# EAGLE board Comms (EAGLE 9.6.2), part 1 of 3
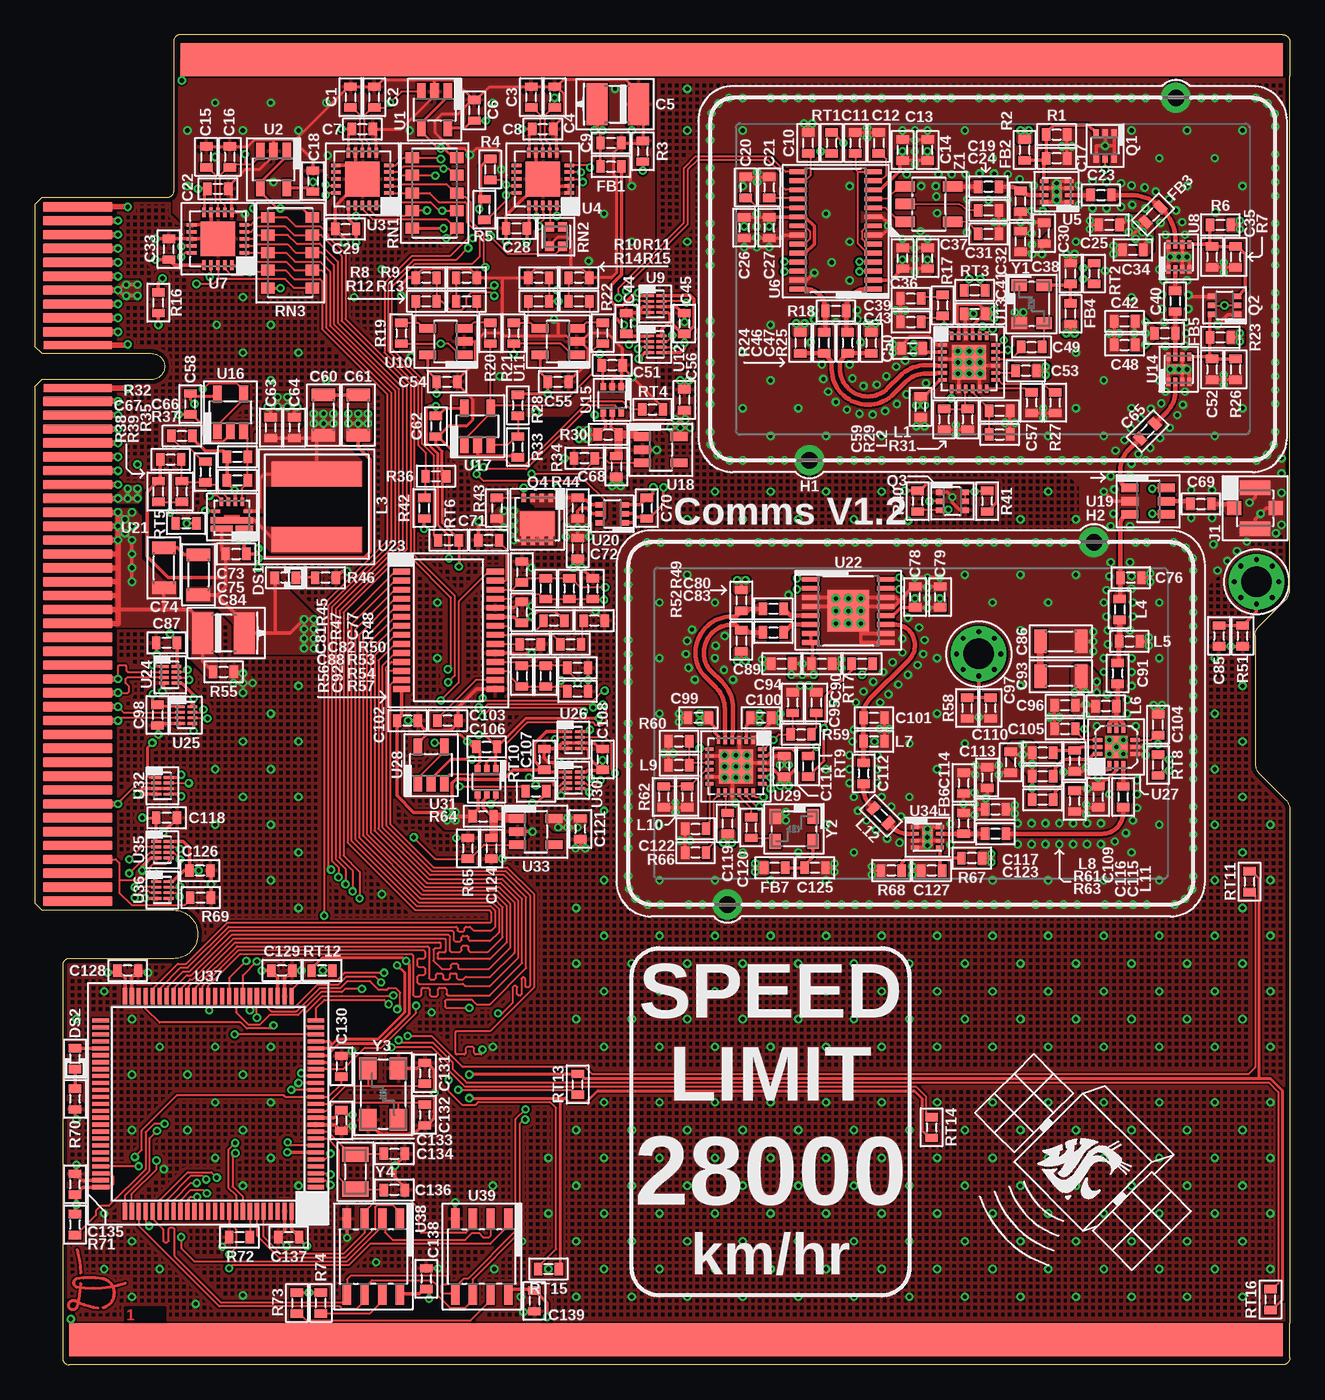
[diagram p14: board, top side]
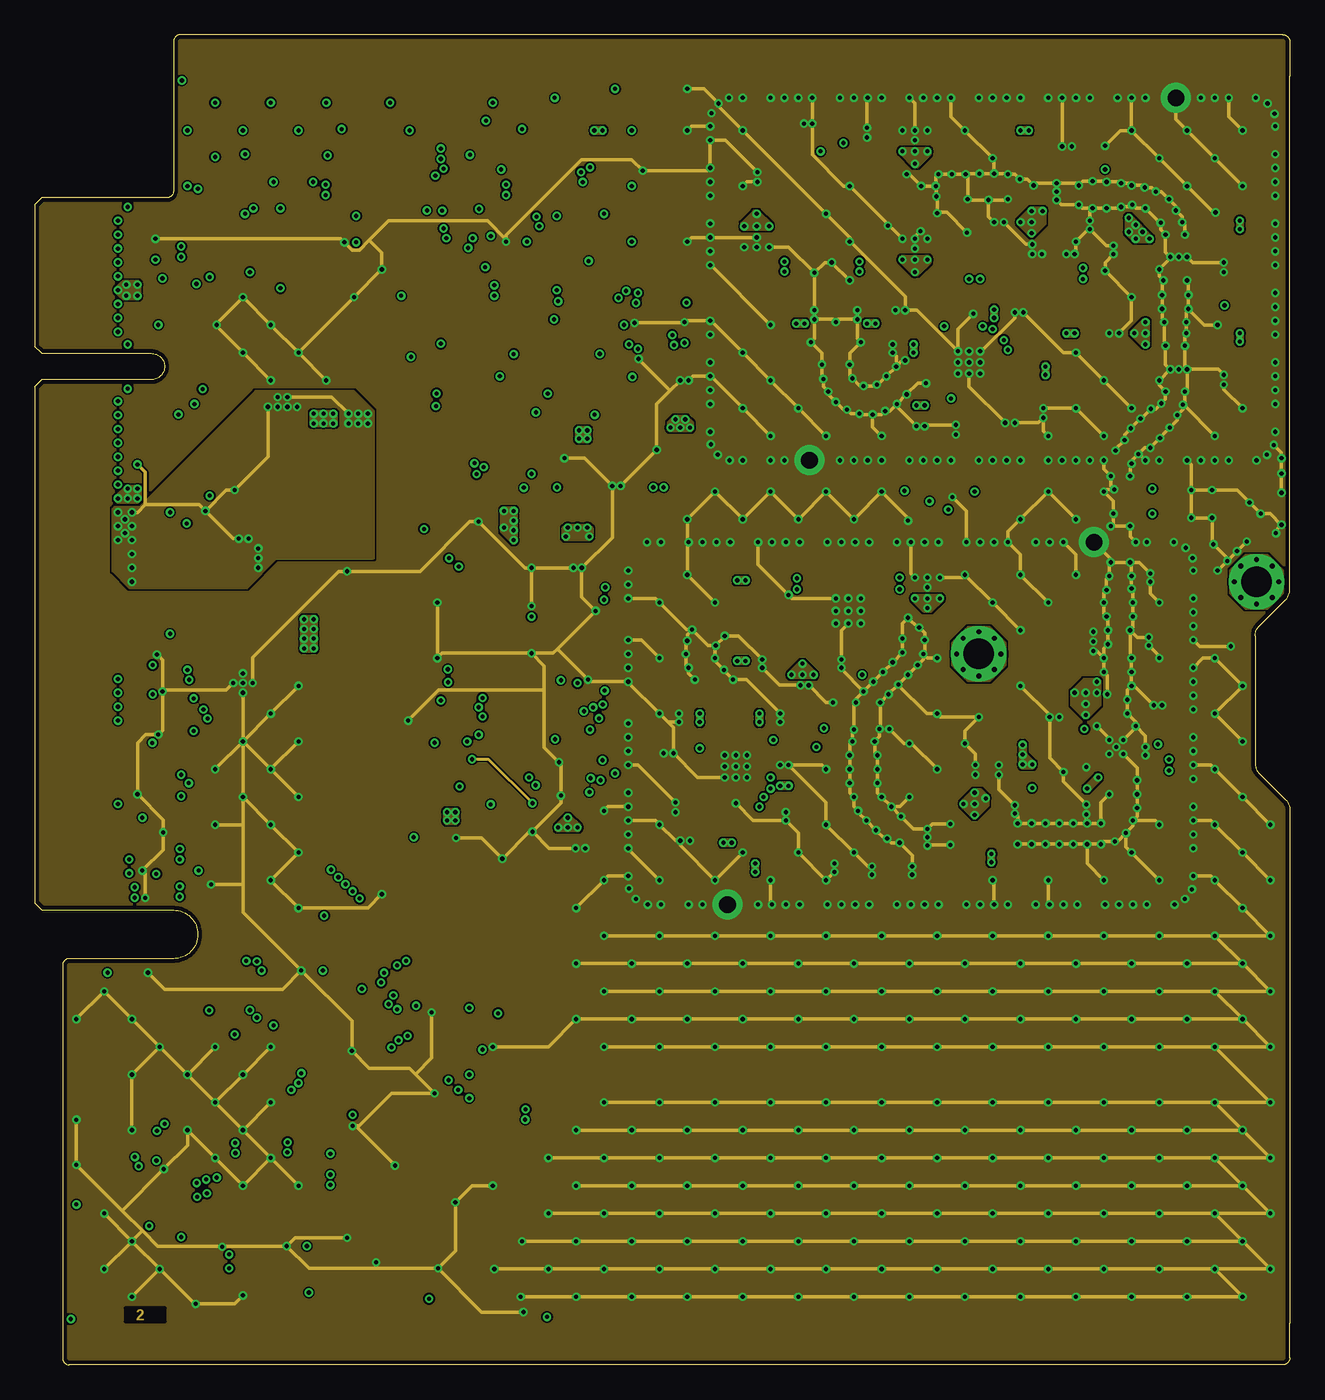
[diagram p15: board, inner layer Route2]
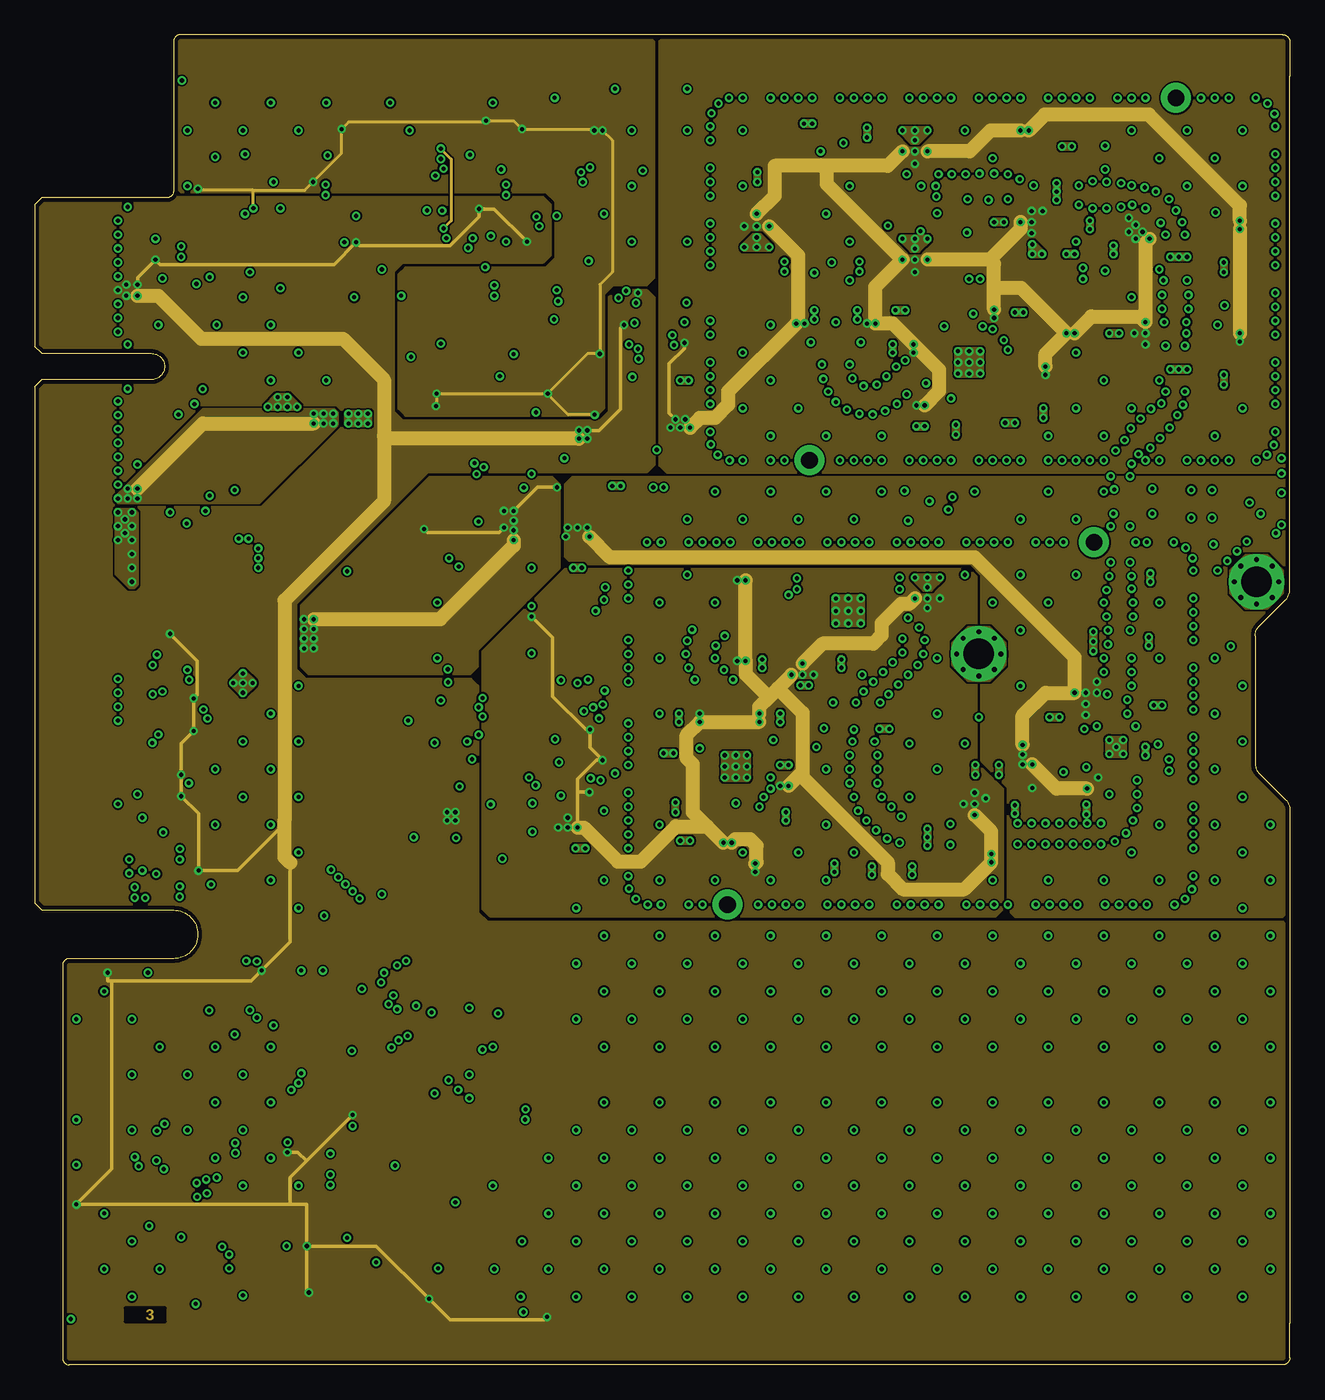
[diagram p16: board, inner layer Route15]
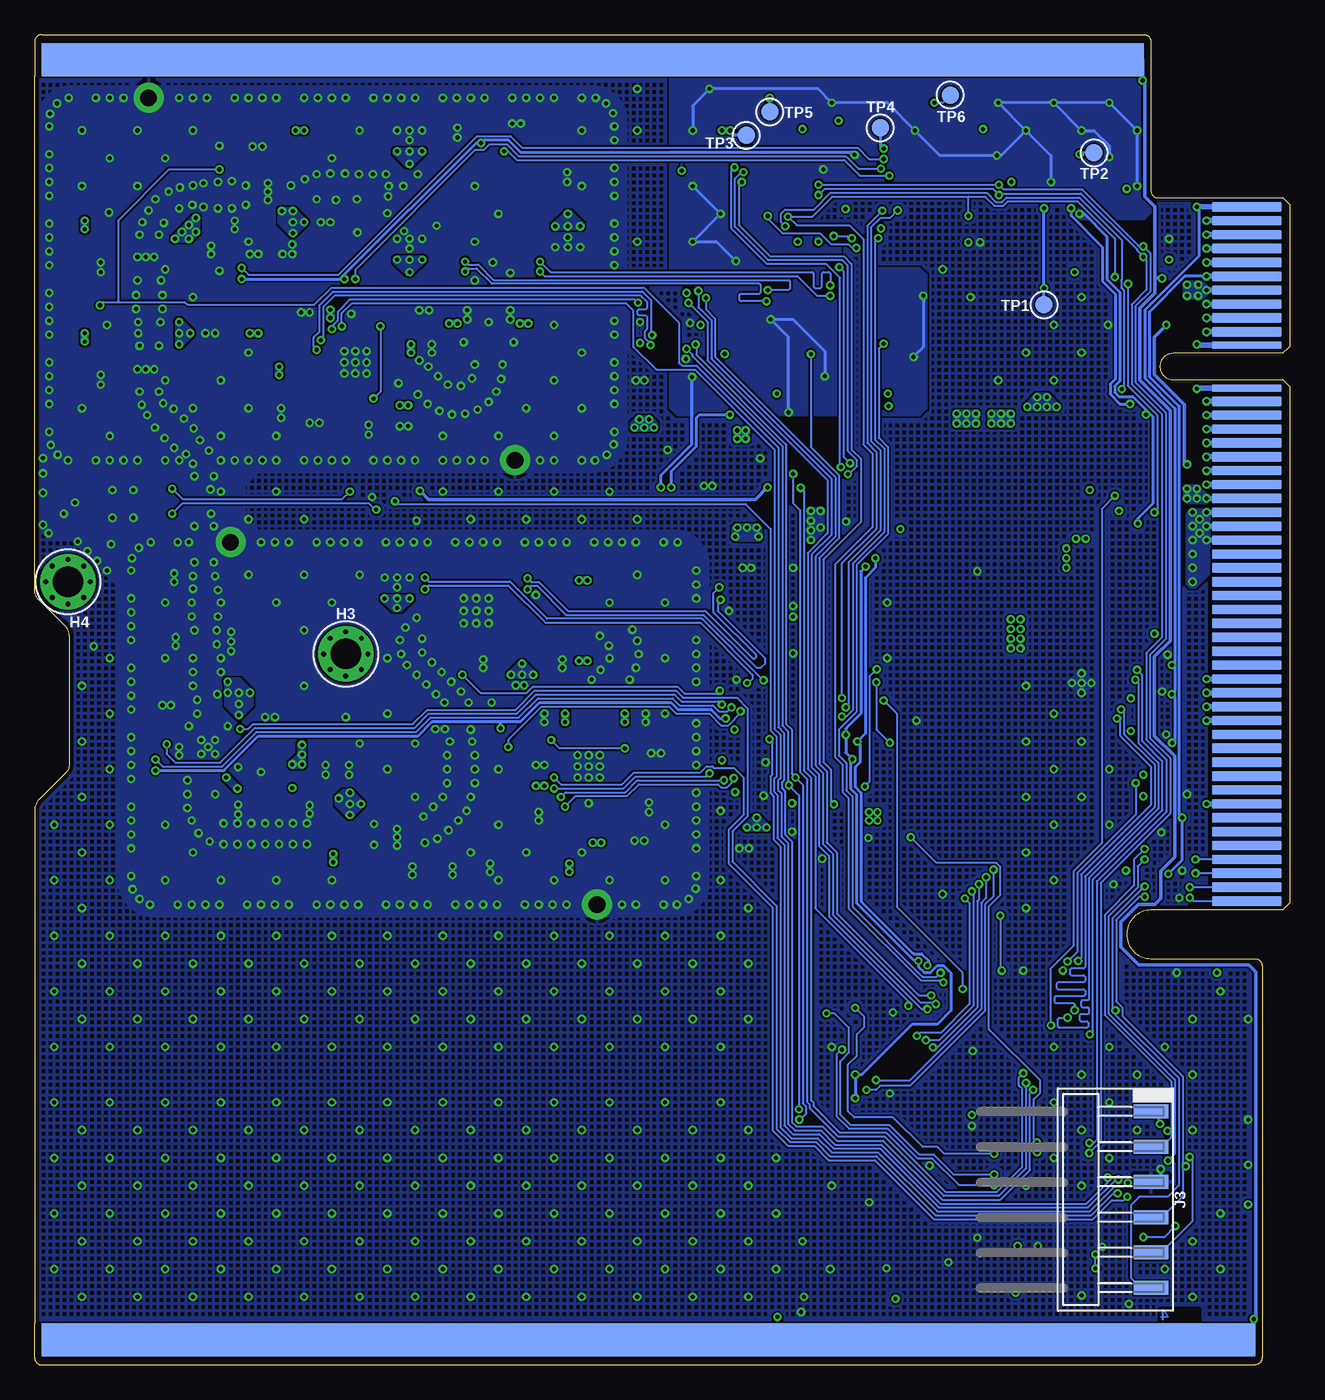
[diagram p17: board, bottom side, seen from below]

Size 90.4 x 95.8 mm. Coordinates in mm from the lower left corner, seen from the top.
Outline: 90.4,3 90.4,39.99 arc45 90.11,40.69 88.19,42.61 arc-45 87.9,43.31 87.9,52.49 arc-45 88.19,53.19 90.11,55.11 arc45 90.4,55.81 90.4,92.8
Copper layers (1+2*15+16): Top 0.035mm / dielectric 0.2mm / Route2 0.0175mm / dielectric 1.065mm / Route15 0.0175mm / dielectric 0.2mm / Bottom 0.035mm
Design rules "CougsInSpace-4Layer *": minimum track width 0.12mm, minimum drill 0.3mm, track to track 0.12mm, track to pad 0.12mm, pad to pad 0.12mm, via to via 0.12mm, smd to smd 0mil, copper to edge 0.3mm, drill to drill 0.3mm, minimum pad ring 0.15mm, minimum via ring 0.15mm, stop-mask expansion 0mil, vias tented up to drill 1mm, thermal gap 0.25mm
Net classes: 0 default: width 0.16 mm; 1 50Ohm: width 0.2 mm, clearance 0.2 mm; 2 200Ohm: width 0.1 mm, clearance 0.16 mm; 3 Supplies: width 0.25 mm; 4 AGND: width 0.2 mm
tRestrict: area 59.1,42.1 to 60.4,43; area 68.8,37.6 to 69.7,38.9; area 77.8,40.5 to 79.1,41.3; area 77.3,49.3 to 78.7,50.2; area 77.5,54 to 78.8,54.8; area 60.2,38.8 to 61.7,40.3; area 52.8,53.8 to 53.7,55.1; area 52.8,52.1 to 53.7,53.4; area 79.4,66.5 to 80.9,68; area 81.5,76.2 to 82.8,77; area 76.3,83.6 to 77.2,84.9; area 68.2,84.2 to 69.2,85.5; area 56.2,73.2 to 57.5,74; area 57.9,73.2 to 59.2,74

## Footprints (pad centres in the part's own frame; a part is rotated, then mirrored left to right if it is on the bottom)
1608 = smd 0.6 x 0.9: 1 -0.75,0; 2 0.75,0
4028-POL = smd 1.5 x 3: A 1.5,0; C -1.5,0
3216 = smd 0.9 x 1.7: 1 -1.45,0; 2 1.45,0
1608-POL = smd 0.6 x 0.9: A 0.75,0; C -0.75,0
SHIELD-2641 = drill 1.2 pad 1.7: 1 13.2,13.05; 2 -13.2,-13.05
MOUNTING_HOLE-2.2 = drill 2.2 pad 4: 1 0,0 | drill 0.35 pad 0.6: V1 1.6,0; V2 1.131,1.131; V3 0,1.6; V4 -1.131,1.131; V5 -1.6,0; V6 -1.131,-1.131; V7 0,-1.6; V8 1.131,-1.131
U.FL = smd 1 x 1: CENTER 0,-1.5; SHIELD@2 0,1.5 | smd 1.05 x 2.2: SHIELD@1 -1.475,0; SHIELD@13 1.475,0
CARD-FULL-OPEN+X = smd 5 x 0.7 bottom: A1 3.1,35.5; A2 3.1,34.5; A3 3.1,33.5; A4 3.1,32.5; A5 3.1,31.5; A6 3.1,30.5; A7 3.1,29.5; A8 3.1,28.5; A9 3.1,27.5; A10 3.1,26.5; A13 3.1,21.5; A14 3.1,20.5; A15 3.1,19.5; A16 3.1,18.5; A17 3.1,17.5; A18 3.1,16.5; A19 3.1,15.5; A20 3.1,14.5; A21 3.1,13.5; A22 3.1,12.5; A23 3.1,11.5; A24 3.1,10.5; A25 3.1,9.5; A26 3.1,8.5; A27 3.1,7.5; A28 3.1,6.5; A29 3.1,5.5; A30 3.1,4.5; A31 3.1,3.5; A32 3.1,2.5; A33 3.1,1.5; A34 3.1,0.5; A35 3.1,-0.5; A36 3.1,-1.5; A37 3.1,-2.5; A38 3.1,-3.5; A39 3.1,-4.5; A40 3.1,-5.5; A41 3.1,-6.5; A42 3.1,-7.5; A43 3.1,-8.5; A44 3.1,-9.5; A45 3.1,-10.5; A46 3.1,-11.5; A47 3.1,-12.5; A48 3.1,-13.5; A49 3.1,-14.5 | smd 5 x 0.6 bottom: A11 3.1,25.55; A12 3.1,22.45 | smd 5 x 0.7: B1 3.1,35.5; B2 3.1,34.5; B3 3.1,33.5; B4 3.1,32.5; B5 3.1,31.5; B6 3.1,30.5; B7 3.1,29.5; B8 3.1,28.5; B9 3.1,27.5; B10 3.1,26.5; B13 3.1,21.5; B14 3.1,20.5; B15 3.1,19.5; B16 3.1,18.5; B17 3.1,17.5; B18 3.1,16.5; B19 3.1,15.5; B20 3.1,14.5; B21 3.1,13.5; B22 3.1,12.5; B23 3.1,11.5; B24 3.1,10.5; B25 3.1,9.5; B26 3.1,8.5; B27 3.1,7.5; B28 3.1,6.5; B29 3.1,5.5; B30 3.1,4.5; B31 3.1,3.5; B32 3.1,2.5; B33 3.1,1.5; B34 3.1,0.5; B35 3.1,-0.5; B36 3.1,-1.5; B37 3.1,-2.5; B38 3.1,-3.5; B39 3.1,-4.5; B40 3.1,-5.5; B41 3.1,-6.5; B42 3.1,-7.5; B43 3.1,-8.5; B44 3.1,-9.5; B45 3.1,-10.5; B46 3.1,-11.5; B47 3.1,-12.5; B48 3.1,-13.5; B49 3.1,-14.5 | smd 5 x 0.6: B11 3.1,25.55; B12 3.1,22.45 | smd 79.4 x 2.4 bottom: CHASSIS@1 50.2,46.1 | smd 79.4 x 2.4: CHASSIS@2 50.2,46.1 | smd 87.4 x 2.4 bottom: CHASSIS@3 46.2,-46.1 | smd 87.4 x 2.4: CHASSIS@4 46.2,-46.1
SMD2.54-1X06-R = smd 1 x 2.5: 1 6.35,-5; 2 3.81,-5; 3 1.27,-5; 4 -1.27,-5; 5 -3.81,-5; 6 -6.35,-5
7575 = smd 1.78 x 6.5: 1 -2.36,0; 2 2.36,0
SOT363 = smd 0.5 x 0.4: 1 -0.95,0.65; 2 -0.95,0; 3 -0.95,-0.65; 4 0.95,-0.65; 5 0.95,0; 6 0.95,0.65
SON-3333 = smd 0.6 x 0.3: 1 -1.55,0.975; 2 -1.55,0.325; 3 -1.55,-0.325; 4 -1.55,-0.975; 5 1.55,-0.975; 6 1.55,-0.325; 7 1.55,0.325; 8 1.55,0.975 | smd 1.775 x 2.45: PAD 0.325,0
3264 = smd 0.79 x 1: 1 -2.54,-1.6; 2 -1.27,-1.6; 3 0,-1.6; 4 1.27,-1.6; 5 2.54,-1.6; 6 2.54,1.6; 7 1.27,1.6; 8 0,1.6; 9 -1.27,1.6; 10 -2.54,1.6
1616 = smd 0.64 x 0.7: 1 -0.47,-0.7; 2 0.47,-0.7; 3 0.47,0.7; 4 -0.47,0.7
SMD-C-1.25 = smd 1.25 x 1.25: 1 0,0
SOT23-5 = smd 1.22 x 0.62: 1 -1.31,0.95; 2 -1.31,0; 3 -1.31,-0.95; 4 1.31,-0.95; 5 1.31,0.95
QFN-20-4040 = smd 0.7 x 0.25: 1 -1.9,1; 2 -1.9,0.5; 3 -1.9,0; 4 -1.9,-0.5; 5 -1.9,-1; 11 1.9,-1; 12 1.9,-0.5; 13 1.9,0; 14 1.9,0.5; 15 1.9,1 | smd 0.25 x 0.7: 6 -1,-1.9; 7 -0.5,-1.9; 8 0,-1.9; 9 0.5,-1.9; 10 1,-1.9; 16 1,1.9; 17 0.5,1.9; 18 0,1.9; 19 -0.5,1.9; 20 -1,1.9 | smd 2.5 x 2.5: PAD 0,0
DFN-8-2020 = smd 0.6 x 0.28: 1 -0.9,0.75; 2 -0.9,0.25; 3 -0.9,-0.25; 4 -0.9,-0.75; 5 0.9,-0.75; 6 0.9,-0.25; 7 0.9,0.25; 8 0.9,0.75 | smd 0.7 x 1.3: PAD 0,0
TSSOP-28 = smd 1.25 x 0.35: 1 -2.7,4.225; 2 -2.7,3.575; 3 -2.7,2.925; 4 -2.7,2.275; 5 -2.7,1.625; 6 -2.7,0.975; 7 -2.7,0.325; 8 -2.7,-0.325; 9 -2.7,-0.975; 10 -2.7,-1.625; 11 -2.7,-2.275; 12 -2.7,-2.925; 13 -2.7,-3.575; 14 -2.7,-4.225; 15 2.7,-4.225; 16 2.7,-3.575; 17 2.7,-2.925; 18 2.7,-2.275; 19 2.7,-1.625; 20 2.7,-0.975; 21 2.7,-0.325; 22 2.7,0.325; 23 2.7,0.975; 24 2.7,1.625; 25 2.7,2.275; 26 2.7,2.925; 27 2.7,3.575; 28 2.7,4.225
X2SON-8 = smd 0.2 x 0.7: 1 0.6,0.45; 2 0.2,0.45; 3 -0.2,0.45; 4 -0.6,0.45; 5 -0.6,-0.45; 6 -0.2,-0.45; 7 0.2,-0.45; 8 0.6,-0.45
QFN-24-4040 = smd 0.6 x 0.25: 1 -1.9,1.25; 2 -1.9,0.75; 3 -1.9,0.25; 4 -1.9,-0.25; 5 -1.9,-0.75; 6 -1.9,-1.25; 13 1.9,-1.25; 14 1.9,-0.75; 15 1.9,-0.25; 16 1.9,0.25; 17 1.9,0.75; 18 1.9,1.25 | smd 0.25 x 0.6: 7 -1.25,-1.9; 8 -0.75,-1.9; 9 -0.25,-1.9; 10 0.25,-1.9; 11 0.75,-1.9; 12 1.25,-1.9; 19 1.25,1.9; 20 0.75,1.9; 21 0.25,1.9; 22 -0.25,1.9; 23 -0.75,1.9; 24 -1.25,1.9 | smd 2.45 x 2.45: PAD 0,0
SOT23-6 = smd 1.22 x 0.62: 1 -1.31,0.95; 2 -1.31,0; 3 -1.31,-0.95; 4 1.31,-0.95; 5 1.31,0; 6 1.31,0.95
QFN-TPS6123X = smd 1.25 x 0.43: 1 -0.9,0.77 | smd 3.05 x 0.45: 2 0,0.17 | smd 0.6 x 0.25: 3 -1.15,-0.475; 8 1.15,-0.475 | smd 0.25 x 0.6: 4 -0.75,-1.15; 5 -0.25,-1.15; 6 0.25,-1.15; 7 0.75,-1.15 | smd 1.6 x 0.43: 9 0.725,0.77
TSSOP-16 = smd 1.25 x 0.35: 1 -2.7,2.275; 2 -2.7,1.625; 3 -2.7,0.975; 4 -2.7,0.325; 5 -2.7,-0.325; 6 -2.7,-0.975; 7 -2.7,-1.625; 8 -2.7,-2.275; 9 2.7,-2.275; 10 2.7,-1.625; 11 2.7,-0.975; 12 2.7,-0.325; 13 2.7,0.325; 14 2.7,0.975; 15 2.7,1.625; 16 2.7,2.275 | smd 3 x 3: PAD 0,0
SSOP-28 = smd 1.25 x 0.42: 1 -3.375,4.225; 2 -3.375,3.575; 3 -3.375,2.925; 4 -3.375,2.275; 5 -3.375,1.625; 6 -3.375,0.975; 7 -3.375,0.325; 8 -3.375,-0.325; 9 -3.375,-0.975; 10 -3.375,-1.625; 11 -3.375,-2.275; 12 -3.375,-2.925; 13 -3.375,-3.575; 14 -3.375,-4.225; 15 3.375,-4.225; 16 3.375,-3.575; 17 3.375,-2.925; 18 3.375,-2.275; 19 3.375,-1.625; 20 3.375,-0.975; 21 3.375,-0.325; 22 3.375,0.325; 23 3.375,0.975; 24 3.375,1.625; 25 3.375,2.275; 26 3.375,2.925; 27 3.375,3.575; 28 3.375,4.225
QFN-12-3030 = smd 0.7 x 0.3: 1 -1.35,0.5; 2 -1.35,0; 3 -1.35,-0.5; 7 1.35,-0.5; 8 1.35,0; 9 1.35,0.5 | smd 0.3 x 0.7: 4 -0.5,-1.35; 5 0,-1.35; 6 0.5,-1.35; 10 0.5,1.35; 11 0,1.35; 12 -0.5,1.35 | smd 1.6 x 1.6: PAD 0,0
QFP-100-1414 = smd 1.2 x 0.3: 1 -7.75,6; 2 -7.75,5.5; 3 -7.75,5; 4 -7.75,4.5; 5 -7.75,4; 6 -7.75,3.5; 7 -7.75,3; 8 -7.75,2.5; 9 -7.75,2; 10 -7.75,1.5; 11 -7.75,1; 12 -7.75,0.5; 13 -7.75,0; 14 -7.75,-0.5; 15 -7.75,-1; 16 -7.75,-1.5; 17 -7.75,-2; 18 -7.75,-2.5; 19 -7.75,-3; 20 -7.75,-3.5; 21 -7.75,-4; 22 -7.75,-4.5; 23 -7.75,-5; 24 -7.75,-5.5; 25 -7.75,-6; 51 7.75,-6; 52 7.75,-5.5; 53 7.75,-5; 54 7.75,-4.5; 55 7.75,-4; 56 7.75,-3.5; 57 7.75,-3; 58 7.75,-2.5; 59 7.75,-2; 60 7.75,-1.5; 61 7.75,-1; 62 7.75,-0.5; 63 7.75,0; 64 7.75,0.5; 65 7.75,1; 66 7.75,1.5; 67 7.75,2; 68 7.75,2.5; 69 7.75,3; 70 7.75,3.5; 71 7.75,4; 72 7.75,4.5; 73 7.75,5; 74 7.75,5.5; 75 7.75,6 | smd 0.3 x 1.2: 26 -6,-7.75; 27 -5.5,-7.75; 28 -5,-7.75; 29 -4.5,-7.75; 30 -4,-7.75; 31 -3.5,-7.75; 32 -3,-7.75; 33 -2.5,-7.75; 34 -2,-7.75; 35 -1.5,-7.75; 36 -1,-7.75; 37 -0.5,-7.75; 38 0,-7.75; 39 0.5,-7.75; 40 1,-7.75; 41 1.5,-7.75; 42 2,-7.75; 43 2.5,-7.75; 44 3,-7.75; 45 3.5,-7.75; 46 4,-7.75; 47 4.5,-7.75; 48 5,-7.75; 49 5.5,-7.75; 50 6,-7.75; 76 6,7.75; 77 5.5,7.75; 78 5,7.75; 79 4.5,7.75; 80 4,7.75; 81 3.5,7.75; 82 3,7.75; 83 2.5,7.75; 84 2,7.75; 85 1.5,7.75; 86 1,7.75; 87 0.5,7.75; 88 0,7.75; 89 -0.5,7.75; 90 -1,7.75; 91 -1.5,7.75; 92 -2,7.75; 93 -2.5,7.75; 94 -3,7.75; 95 -3.5,7.75; 96 -4,7.75; 97 -4.5,7.75; 98 -5,7.75; 99 -5.5,7.75; 100 -6,7.75
SO8 = smd 1.55 x 0.6: 1 -2.7,1.905; 2 -2.7,0.635; 3 -2.7,-0.635; 4 -2.7,-1.905; 5 2.7,-1.905; 6 2.7,-0.635; 7 2.7,0.635; 8 2.7,1.905
SMD-3225 = smd 0.85 x 1.1: 1 -1.365,-0.9; 2 1.365,-0.9; 3 1.365,0.9; 4 -1.365,0.9
SMD-5032 = smd 1.6 x 1.25: 1 -1.85,-1.1; 2 1.85,-1.1; 3 1.85,1.1; 4 -1.85,1.1
SMD-3215 = smd 1.1 x 1.9: 1 -1.25,0; 2 1.25,0
SM-22 = smd 0.76 x 1.4: 1 -1.27,1.715; 2 0,1.715; 3 1.27,1.715; 4 1.27,-1.715; 5 -1.27,-1.715

## Placement (x,y rotation side)
C1  1µF 10%  [1608]  22.75,91.3 90 top
C2  10µF 10%  [1608]  24.45,91.3 90 top
C3  1µF 10%  [1608]  35.75,91.3 90 top
C4  10µF 10%  [1608]  37.45,91.3 90 top
C5  4.7µF 10%  [4028-POL]  42,90.8 180 top
C6  100nF 10%  [1608]  31.65,90.35 90 top
C7  100nF 10%  [1608]  23.6,89 0 top
C8  100nF 10%  [1608]  36.6,89 0 top
C9  100nF 10%  [1608]  41.5,88 0 top
C10  100nF 10%  [1608]  55.7,88 90 top
C11  1µF 10%  [1608]  59.1,88 90 top
C12  100nF 10%  [1608]  60.8,88 90 top
C13  100pF 1%  [1608]  62.5,87.5 90 top
C14  100nF 10%  [1608]  64.3,87.5 90 top
C15  1µF 10%  [1608]  12.35,87 90 top
C16  10µF 10%  [1608]  14.05,87 90 top
C17  1nF 1%  [1608]  73.6,86.9 0 top
C18  100nF 10%  [1608]  20.05,85.25 90 top
C19  100pF 1%  [1608]  68.7,84.85 180 top
C20  1nF 1%  [1608]  51.2,84.8 90 top
C21  1nF 1%  [1608]  52.9,84.8 90 top
C22  100nF 10%  [1608]  13.2,84.7 0 top
C23  1nF 1%  [1608]  76.8,84.25 180 top
C24  1µF 10%  [1608]  68.7,83.15 0 top
C25  1nF 1%  [1608]  77.4,82.1 180 top
C26  100nF 10%  [1608]  51.1,81.9 270 top
C27  100pF 1%  [1608]  52.9,81.9 270 top
C28  100nF 10%  [1608]  34.7,81.85 180 top
C29  100nF 10%  [1608]  22.4,81.8 180 top
C30  100nF 10%  [1608]  72.7,81.5 270 top
C31  100pF 1%  [1608]  68.7,81.45 180 top
C32  1nF 1%  [1608]  71,80.9 270 top
C33  100nF 10%  [1608]  9.65,80.35 90 top
C34  100nF 10%  [1608]  79.1,80.3 180 top
C35  1nF 1%  [1608]  84.8,79.8 270 top
C36  100pF 1%  [1608]  62.5,79.7 90 top
C37  100nF 10%  [1608]  64.3,79.7 90 top
C38  100nF 10%  [1608]  74.6,78.6 90 top
C39  150pF 5%  [1608]  63.1,76.8 180 top
C40  1nF 1%  [1608]  82.15,76.6 90 top
C41  100nF 10%  [1608]  67.7,75.7 180 top
C42  1nF 1%  [1608]  78.5,75.15 180 top
C43  33pF 5%  [1608]  63.1,75.1 180 top
C44  100nF 10%  [1608]  42.6,75 90 top
C45  100nF 10%  [1608]  46.8,75 90 top
C46  1nF 1%  [1608]  56.85,73.6 90 top
C47  1nF 1%  [1608]  58.55,73.6 90 top
C48  100nF 10%  [1608]  78.5,73.45 180 top
C49  1nF 1%  [1608]  71.8,73.3 180 top
C50  100nF 10%  [1608]  63.2,73.2 180 top
C51  100nF 10%  [1608]  41.6,72 0 top
C52  1nF 1%  [1608]  84.8,71.7 270 top
C53  1µF 10%  [1608]  71.4,71.6 180 top
C54  100nF 10%  [1608]  29.7,70.8 0 top
C55  100nF 10%  [1608]  37.7,70.8 0 top
C56  1µF 10%  [1608]  46.8,69.5 90 top
C57  10nF 10%  [1608]  71.8,69.3 270 top
C58  100nF 10%  [1608]  11.2,69.2 270 top
C59  100nF 10%  [1608]  63.8,69 270 top
C60  10µF 10%  [3216]  20.8,68.4 90 top
C61  10µF 10%  [3216]  23.3,68.4 270 top
C62  100nF 10%  [1608]  28.9,67.6 270 top
C63  1µF 10%  [1608]  17,67.5 90 top
C64  100nF 10%  [1608]  18.7,67.5 90 top
C65  1nF 1%  [1608]  80.15,67.25 45 top
C66  10nF 10%  [1608]  14.6,65.4 180 top
C67  4.7pF ±0.1  [1608]  9.8,65.2 0 top
C68  1µF 10%  [1608]  41.9,64.7 270 top
C69  1nF 1%  [1608]  84,62 0 top
C70  100nF 10%  [1608]  44.1,61.7 270 top
C71  100nF 10%  [1608]  32.7,59.4 180 top
C72  1µF 10%  [1608]  39.1,58.8 270 top
C73  1µF 10%  [1608]  14.5,58.4 0 top
C74  10µF 10%  [3216]  9.3,57.4 270 top
C75  10µF 10%  [3216]  11.8,56.9 90 top
C76  18pF 1%  [1608]  78.95,56.7 0 top
C77  3.9nF 5%  [1608]  38.5,55.9 270 top
C78  100pF 1%  [1608]  63.4,55.3 90 top
C79  10nF 10%  [1608]  65.2,55.3 90 top
C80  1nF 1%  [1608]  53.2,54.45 0 top
C81  100nF 10%  [1608]  35.1,54.2 90 top
C82  100nF 10%  [1608]  37.4,53.6 180 top
C83  1nF 1%  [1608]  53.2,52.75 0 top
C84  47µF  [4028-POL]  13.6,52.7 0 top
C85  100nF 10%  [1608]  85.3,52.5 270 top
C86  10µF 10%  [3216]  73.9,52.1 0 top
C87  100nF 10%  [1608]  9.5,52 180 top
C88  100nF 10%  [1608]  35.7,51.9 0 top
C89  10nF 10%  [1608]  53.8,50.5 180 top
C90  100pF 1%  [1608]  56.7,50.5 0 top
C91  220pF 1%  [1608]  78,49.8 90 top
C92  3.9nF 5%  [1608]  36.8,49.6 90 top
C93  10µF 10%  [3216]  73.9,49.6 180 top
C94  56pF 2%  [1608]  54.6,47.7 90 top
C95  270pF 1%  [1608]  56.3,47.7 90 top
C96  1nF 1%  [1608]  74.2,47.5 180 top
C97  100nF 10%  [1608]  68.85,47.3 270 top
C98  100nF 10%  [1608]  8.85,46.8 270 top
C99  100nF 10%  [1608]  47.8,46.6 180 top
C100  100nF 10%  [1608]  52.3,46.6 0 top
C101  22pF 5%  [1608]  60.45,46.6 0 top
C102  100nF 10%  [1608]  26.85,46.4 0 top
C103  100nF 10%  [1608]  29.75,46.4 0 top
C104  100pF 1%  [1608]  80.9,46.1 90 top
C105  100pF 1%  [1608]  74.2,45.8 180 top
C106  100nF 10%  [1608]  32.55,44.5 0 top
C107  100nF 10%  [1608]  36.7,43.6 90 top
C108  100nF 10%  [1608]  40.9,43.6 90 top
C109  2.4pF ±0.1pF  [1608]  74.9,43.5 270 top
C110  1µF 10%  [1608]  70.3,43.4 270 top
C111  100nF 10%  [1608]  54,43.1 90 top
C112  2.4pF ±0.1pF  [1608]  59.7,42.6 270 top
C113  100nF 10%  [1608]  68.6,42.3 90 top
C114  47pF 5%  [1608]  66.9,41.9 90 top
C115  100pF 1%  [1608]  76.6,40.9 270 top
C116  1µF 10%  [1608]  74.9,40.6 270 top
C117  1nF 1%  [1608]  69.2,40 0 top
C118  100nF 10%  [1608]  9.5,39.4 0 top
C119  1µF 10%  [1608]  49.9,39 90 top
C120  1nF 1%  [1608]  51.6,38.7 90 top
C121  1µF 10%  [1608]  39.3,38.6 270 top
C122  10nF 10%  [1608]  47.6,38.6 180 top
C123  1nF 1%  [1608]  69.2,38.25 0 top
C124  1µF 10%  [1608]  32.9,37.2 270 top
C125  100nF 10%  [1608]  56.2,35.8 0 top
C126  100nF 10%  [1608]  11.9,35.6 0 top
C127  1nF 1%  [1608]  64.6,35.6 180 top
C128  100nF 10%  [1608]  6.7,28.4 0 top
C129  100nF 10%  [1608]  17.8,28.4 0 top
C130  100nF 10%  [1608]  22.1,21.5 90 top
C131  8pF ±0.25  [1608]  28.1,21 90 top
C132  8pF ±0.25  [1608]  28.1,18 270 top
C133  100nF 10%  [1608]  22.1,17.6 270 top
C134  15pF 1%  [1608]  25.9,15.2 0 top
C135  100nF 10%  [1608]  2.9,13 90 top
C136  15pF 1%  [1608]  25.9,12.6 0 top
C137  100nF 10%  [1608]  18.3,9.2 180 top
C138  100nF 10%  [1608]  28.2,6.2 90 top
C139  100nF 10%  [1608]  36,4.6 270 top
DS1  Green  [1608-POL]  18.05,56.7 180 top
DS2  Green  [1608-POL]  2.9,22.05 90 top
FB1  1.5kΩ @ 100MHz  [1608]  41.5,86.3 180 top
FB2  1.5kΩ @ 100MHz  [1608]  71,83.8 270 top
FB3  1.5kΩ @ 100MHz  [1608]  80.55,82.85 225 top
FB4  1.5kΩ @ 100MHz  [1608]  74.6,75.7 270 top
FB5  1.5kΩ @ 100MHz  [1608]  81.4,74.3 180 top
FB6  1.5kΩ @ 100MHz  [1608]  66.9,39 90 top
FB7  1.5kΩ @ 100MHz  [1608]  53.3,35.8 180 top
H1  Can - Demodulator  [SHIELD-2641]  69,78.2 0 top
H2  Can - Modulator  [SHIELD-2641]  63.1,46.2 0 top
H3  M2  [MOUNTING_HOLE-2.2]  68,51.2 0 bottom
H4  M2  [MOUNTING_HOLE-2.2]  88,56.4 0 bottom
J1  700mm Antenna  [U.FL]  87.9,61.7 270 top
J2  CougSat Card  [CARD-FULL-OPEN+X]  0,47.9 0 top
J3  SWD  [SMD2.54-1X06-R]  15,11.9 90 bottom
L1  4.3nH 2%  [1608]  69.5,68.7 180 top
L2  4.3nH 2%  [1608]  67.2,68.1 90 top
L3  1.0µH 20%  [7575]  20.3,61.8 270 top
L4  5.6nH 2%  [1608]  78.15,54.4 90 top
L5  22nH 2%  [1608]  78.85,52.1 180 top
L6  12nH 2%  [1608]  77.15,47.45 180 top
L7  5.6nH 2%  [1608]  60.45,44.9 180 top
L8  5.6nH 2%  [1608]  72.6,44.1 0 top
L9  22nH 2%  [1608]  46.4,43.2 0 top
L10  22nH 2%  [1608]  47,40.9 90 top
L11  3.9nH ±0.1nH  [1608]  78.4,40.9 90 top
L12  56nH 2%  [1608]  60.95,39.55 315 top
LOGO1  Satellite 16mm  [CIS-SATELLITE-16]  75.5,14.6 0 top
LOGO2  SIGNATUREBRADLEY  [SIGN-BRADLEY]  4.55,6.1 0 top
LOGO3  Speed Limit  [SPEED_LIMIT]  53,18 0 top
Q1  DMN53D0LDW  [SOT363]  77.1,87.8 270 top
Q2  DMN53D0LDW  [SOT363]  85.7,76.3 180 top
Q3  DMN53D0LDW  [SOT363]  66.1,62.2 0 top
Q4  CSD25402Q3A  [SON-3333]  36.2,60.9 270 top
R1  2kΩ 0.1%  [1608]  73.6,88.6 180 top
R2  2kΩ 0.1%  [1608]  71.3,87.5 90 top
R3  0Ω <20mΩ  [1608]  43.8,87.4 270 top
R4  10kΩ 0.1%  [1608]  32.8,86.1 90 top
R5  10kΩ 0.1%  [1608]  32.4,83.2 90 top
R6  2kΩ 0.1%  [1608]  85.4,82.1 0 top
R7  2kΩ 0.1%  [1608]  86.5,79.8 90 top
R8  2kΩ 0.1%  [1608]  28.2,78.3 0 top
R9  2kΩ 0.1%  [1608]  31.1,78.3 180 top
R10  2kΩ 0.1%  [1608]  36.3,78.3 0 top
R11  2kΩ 0.1%  [1608]  39.2,78.3 180 top
R12  100kΩ 0.1%  [1608]  28.2,76.6 180 top
R13  100kΩ 0.1%  [1608]  31.1,76.6 0 top
R14  100kΩ 0.1%  [1608]  36.3,76.6 180 top
R15  100kΩ 0.1%  [1608]  39.2,76.6 0 top
R16  0Ω <20mΩ  [1608]  8.9,76.5 270 top
R17  102kΩ 0.1%  [1608]  65.4,76.3 270 top
R18  60.4Ω 0.1%  [1608]  57.7,75.9 0 top
R19  100kΩ 0.1%  [1608]  26.4,74.3 270 top
R20  100kΩ 0.1%  [1608]  32.8,74.3 270 top
R21  100kΩ 0.1%  [1608]  34.5,74.3 270 top
R22  100kΩ 0.1%  [1608]  40.9,74.3 270 top
R23  2kΩ 0.1%  [1608]  85.4,74 0 top
R24  49.9Ω 0.1%  [1608]  55.15,73.6 90 top
R25  49.9Ω 0.1%  [1608]  60.25,73.6 90 top
R26  2kΩ 0.1%  [1608]  86.5,71.7 90 top
R27  4.7kΩ 0.1%  [1608]  73.5,69.3 90 top
R28  100kΩ 0.1%  [1608]  34.8,69.1 90 top
R29  470Ω 0.5%  [1608]  65.5,68.1 90 top
R30  50mΩ 1%  [1608]  41.3,67 180 top
R31  470Ω 0.5%  [1608]  69.5,67 180 top
R32  330kΩ 1%  [1608]  10.6,66.9 180 top
R33  100kΩ 0.1%  [1608]  34.8,66.1 90 top
R34  10kΩ 0.1%  [1608]  39.6,65.3 0 top
R35  0Ω <20mΩ  [1608]  12.3,64.3 270 top
R36  10kΩ 0.1%  [1608]  28.9,64 180 top
R37  158kΩ 0.1%  [1608]  14.6,63.7 0 top
R38  1MΩ 1%  [1608]  8.9,62.9 90 top
R39  0Ω <20mΩ  [1608]  10.6,62.9 270 top
R40  10kΩ 0.1%  [1608]  63.6,62.2 90 top
R41  10kΩ 0.1%  [1608]  68.6,62.2 270 top
R42  20kΩ 0.5%  [1608]  28.05,61.7 270 top
R43  10kΩ 0.1%  [1608]  33.3,61.7 270 top
R44  50mΩ 1%  [1608]  39.1,61.7 90 top
R45  698Ω 0.1%  [1608]  35.1,57.1 270 top
R46  1kΩ 0.1%  [1608]  20.95,56.7 180 top
R47  1kΩ 0.1%  [1608]  36.8,55.9 90 top
R48  698Ω 0.1%  [1608]  40.2,55.9 270 top
R49  49.9Ω 0.1%  [1608]  50.9,55.05 90 top
R50  8.45kΩ 0.1%  [1608]  40.3,53.6 180 top
R51  0Ω <20mΩ  [1608]  87,52.5 90 top
R52  49.9Ω 0.1%  [1608]  50.9,52.15 270 top
R53  1kΩ 0.1%  [1608]  38.6,51.9 180 top
R54  698Ω 0.1%  [1608]  39.1,50.2 180 top
R55  0Ω <20mΩ  [1608]  13.6,49.9 0 top
R56  1kΩ 0.1%  [1608]  35.1,49.6 270 top
R57  698Ω 0.1%  [1608]  39.1,48.5 180 top
R58  0Ω <20mΩ  [1608]  67.15,47.3 90 top
R59  102kΩ 0.1%  [1608]  55.2,45.4 180 top
R60  470Ω 0.5%  [1608]  46.4,44.9 0 top
R61  2kΩ 0.1%  [1608]  72.6,42.4 180 top
R62  470Ω 0.5%  [1608]  45.3,40.9 90 top
R63  1.74kΩ 0.1%  [1608]  72.6,40.7 180 top
R64  50mΩ 1%  [1608]  32.3,39.5 180 top
R65  10kΩ 0.1%  [1608]  31.2,37.2 270 top
R66  4.7kΩ 0.1%  [1608]  47.6,36.9 0 top
R67  2kΩ 0.1%  [1608]  67.5,36.5 0 top
R68  2kΩ 0.1%  [1608]  61.7,35.6 0 top
R69  1kΩ 0.1%  [1608]  11.95,33.65 180 top
R70  1kΩ 0.1%  [1608]  2.9,19.15 90 top
R71  1kΩ 0.1%  [1608]  2.9,10.1 90 top
R72  0Ω <20mΩ  [1608]  14.75,9.2 0 top
R73  10kΩ 0.1%  [1608]  18.9,4.45 90 top
R74  10kΩ 0.1%  [1608]  20.6,4.45 90 top
RN1  10kΩ 5%  [3264]  28.8,84.4 270 top
RN2  5kΩ 0.1%  [1616]  37.55,81.25 0 top
RN3  10kΩ 5%  [3264]  18.4,80.1 270 top
RT1  10kΩ 5%  [1608]  57.4,88 90 top
RT2  10kΩ 5%  [1608]  76.3,78.6 270 top
RT3  10kΩ 5%  [1608]  67.7,77.4 0 top
RT4  10kΩ 5%  [1608]  44.5,68.8 0 top
RT5  10kΩ 5%  [1608]  10.9,60.6 0 top
RT6  10kΩ 5%  [1608]  29.8,59.4 0 top
RT7  10kΩ 5%  [1608]  59.6,50.5 180 top
RT8  10kΩ 5%  [1608]  80.9,43.2 270 top
RT9  10kΩ 5%  [1608]  55.7,43.1 270 top
RT10  10kΩ 5%  [1608]  36.1,41.3 0 top
RT11  10kΩ 5%  [1608]  87.5,34.8 90 top
RT12  10kΩ 5%  [1608]  20.7,28.4 180 top
RT13  10kΩ 5%  [1608]  39.1,20.2 90 top
RT14  10kΩ 5%  [1608]  64.6,17.1 270 top
RT15  10kΩ 5%  [1608]  37,6.9 0 top
RT16  10kΩ 5%  [1608]  89,4.7 270 top
TP1  TEST_POINT-SMD-C-1.25  [SMD-C-1.25]  17.7,76.35 180 bottom
TP2  TEST_POINT-SMD-C-1.25  [SMD-C-1.25]  14.1,87.3 180 bottom
TP3  TEST_POINT-SMD-C-1.25  [SMD-C-1.25]  39.15,88.55 0 bottom
TP4  TEST_POINT-SMD-C-1.25  [SMD-C-1.25]  29.5,89.1 180 bottom
TP5  TEST_POINT-SMD-C-1.25  [SMD-C-1.25]  37.45,90.25 180 bottom
TP6  TEST_POINT-SMD-C-1.25  [SMD-C-1.25]  24.45,91.45 180 bottom
U1  AD8515  [SOT23-5]  28.8,90.4 270 top
U2  AD8515  [SOT23-5]  17.2,86.1 270 top
U3  AD7291  [QFN-20-4040]  23.6,85.4 180 top
U4  AD7291  [QFN-20-4040]  36.6,85.4 180 top
U5  MAAM-011229  [DFN-8-2020]  73.6,84.5 180 top
U6  AD8348  [TSSOP-28]  57.7,81.7 180 top
U7  AD7291  [QFN-20-4040]  13.2,81.1 180 top
U8  MAAM-011229  [DFN-8-2020]  82.4,79.8 90 top
U9  TXS0102DQM  [X2SON-8]  44.7,76.4 90 top
U10  AD8515  [SOT23-5]  29.6,73.7 180 top
U11  AD8515  [SOT23-5]  37.7,73.7 180 top
U12  TXS0102DQM  [X2SON-8]  44.7,73.5 90 top
U13  ADF4360  [QFN-24-4040]  67.3,72.2 0 top
U14  MAAM-011229  [DFN-8-2020]  82.4,71.7 90 top
U15  INA199C2  [SOT363]  41.6,69.5 270 top
U16  AD8515  [SOT23-5]  14.1,68.6 90 top
U17  AD8515  [SOT23-5]  31.9,67.6 90 top
U18  LP5907MFX-3.1  [SOT23-5]  45.1,65.9 0 top
U19  HMC545A  [SOT23-6]  80.2,62.2 0 top
U20  INA199C1  [SOT363]  41.6,61.3 180 top
U21  TPS61236  [QFN-TPS6123X]  14.2,61 180 top
U22  AD8345  [TSSOP-16]  58.6,54.3 0 top
U23  AD9761  [SSOP-28]  29.8,52.9 0 top
U24  TXS0102DQM  [X2SON-8]  9.75,49.7 90 top
U25  TXS0102DQM  [X2SON-8]  10.9,46.8 90 top
U26  TXS0102DQM  [X2SON-8]  38.8,45 90 top
U27  MMZ09332B  [QFN-12-3030]  77.9,44.5 90 top
U28  AD8515  [SOT23-5]  28.55,43.2 90 top
U29  ADF4360  [QFN-24-4040]  50.5,43.1 270 top
U30  TXS0102DQM  [X2SON-8]  38.8,42.1 90 top
U31  INA199C2  [SOT363]  32.55,42 270 top
U32  TXS0102DQM  [X2SON-8]  9.2,41.7 90 top
U33  LP5907MFX-3.1  [SOT23-5]  36.1,38.4 0 top
U34  MAAM-011229  [DFN-8-2020]  64.3,38 0 top
U35  TXS0102DQM  [X2SON-8]  9.2,37.1 90 top
U36  TXS0102DQM  [X2SON-8]  9.2,34.2 90 top
U37  STM32L496VGT  [QFP-100-1414]  12.5,18.8 180 top
U38  IS25LP016D  [SO8]  24.4,7.8 270 top
U39  IS25LP016D  [SO8]  32.2,7.8 270 top
Y1  19.68MHz ±2.5ppm  [SMD-3225]  71.8,76.4 270 top
Y2  19.68MHz ±2.5ppm  [SMD-3225]  54.7,38.6 180 top
Y3  8MHz ±10ppm  [SMD-5032]  25.1,19.5 90 top
Y4  32.768kHz ±10ppm  [SMD-3215]  23.1,13.9 270 top
Z1  Balun 1:4  [SM-22]  64.4,83.6 90 top

## Tracks (layer width: path | path; a pad name or v marks a point on that pad's centre or on a via)
3.1V_1  (via drill 0.3, 0.3 pad 0.2)
  Top 0.25: C114.1 v66.9,40.4 | v66.9,40.4 FB6.2 | v66.9,40.4 v67.7,40.4 | v67.7,39.6 67.7,40 | 67.7,40 v67.7,40.4 | v67.7,41.2 67.7,40.8 | 67.7,40.8 v67.7,40.4 | 67.7,40.8 v68.5,40.8 68.6,40.9 C113.1 | C117.1 67.7,40 | v68.9,36.2 68.9,36.5 | 68.9,36.5 v68.9,36.8 | v51.9,36.1 51.9,35.8 | 51.9,35.8 v51.9,35.5 | v49.6,37.6 49.9,37.6 | 49.9,37.6 v50.2,37.6 | v53.7,41.7 54,41.7 | 54,41.7 v54.3,41.7 | v52.2,46.3 52.2,46.6 | 52.2,46.6 v52.2,46.9 | v50.6,50.7 50.9,50.7 | 50.9,50.7 v51.2,50.7 | v51.2,56.5 51,56.5 | 51,56.5 v50.6,56.5 | C78.1 62.4,54.55 61.83,53.98 U22.12 | C78.1 64.3,54.55 | 64.3,54.55 C79.1 v65.2,55.2 | v64.3,54.5 64.3,54.55 | v64.3,55.2 64.3,54.55 | C78.1 v63.4,55.2 | C89.1 v55.3,50.5 | v55.3,50.5 C90.1 56,50.55 56,52.02 U22.8 U22.7 | v55.3,49.7 v55.3,50.5 | v56.1,49.7 v55.3,49.7 | v54.5,49.7 v55.3,49.7 | v47.9,46.9 47.9,46.6 | 47.9,46.6 v47.9,46.3 | 47.9,46.6 C99.1 48.55,46.35 49,45.9 49,45.5 49.25,45.25 U29.6 | U29.2 51.25,46.05 51.55,46.35 C100.1 52.2,46.6 | U29.21 53.25,42.85 53.75,42.35 C111.1 | U29.23 52.75,43.85 53.3,44.39 54.55,44.39 54.84,44.1 54.84,42.95 54.25,42.35 C111.1 | R67.2 68.9,36.5 | FB7.2 51.9,35.8 | C119.1 49.9,37.6 | C111.1 54,41.7 | R52.2 50.9,50.7 | R49.2 50.9,56.4 51,56.5 | U23.23 34.52,53.88 34.95,53.45 C81.1 35.34,53.45 v35.78,53.88 36.2,54.3 37.45,54.3 C82.1 | U30.8 39.7,42.7 39.8,42.8 40.85,42.8 | 40.85,42.8 C108.1 v40.9,43.55 | U33.5 37.41,39.4 v38.4,39.4 | C121.1 39.3,39.4 v38.4,39.4 | v39.1,38.7 v38.4,38.7 | v38.4,38.7 v37.7,38.7 | v38.4,38.7 v38.4,39.4 | U26.5 39.75,44.4 39.9,44.25 39.9,43.75 40.85,42.8 | U26.8 39.85,45.6 v40,45.75 | U30.5 39.6,41.5 39.85,41.25 v39.95,41.25
  Route15 0.25: v35.78,53.88 37.3,52.36 37.3,48.15 39.7,45.75 v40,45.75 40,44.45 v40.9,43.55 40.45,43.55 39.1,42.2 39.1,41.25 | 39.1,41.25 v39.1,38.7 | v39.95,41.25 39.1,41.25
  Route15 1: v51.9,36.1 52,36.2 52,37.4 51.55,37.85 50.45,37.85 v50.2,37.6 | v49.6,37.6 48.42,38.77 | 48.42,38.77 47.4,39.8 47.4,43.25 46.95,43.7 46.95,45.35 v47.9,46.3 v52.2,46.3 | v52.2,46.9 52.2,47.4 52.88,48.07 | 52.88,48.07 53.52,48.73 | 53.52,48.73 v54.5,49.7 | 52.88,48.07 51.2,49.75 v51.2,50.7 v51.2,56.5 | v63.4,55.2 63,54.8 62.4,54.8 61,53.4 61,52.55 60.4,51.95 56.75,51.95 v55.3,50.5 | v54.3,41.7 55.3,42.7 | 53.52,48.73 55.3,46.95 55.3,42.7 | v67.7,39.6 68.9,38.4 v68.9,36.2 66.95,34.25 62.55,34.25 61.45,35.35 61.45,36.2 55.3,42.35 55.3,42.7 | v39.1,38.7 39.55,38.7 42,36.25 43.66,36.25 46.18,38.77 48.42,38.77
  pour Top (no thermals): 66.6,39.4 68.5,39.4 68.7,39.6 68.7,41 69,41.3 69,41.8 68,41.8 67.6,41.4 66.5,41.4 66.5,39.5
  pour Route2 (no thermals): 66.7,40.5 66.7,40.3 67.6,39.4 67.8,39.4 68.7,40.3 68.7,40.9 68.2,41.4 67.6,41.4
  pour Bottom (no thermals): 66.7,40.5 66.7,40.3 67.6,39.4 67.8,39.4 68.7,40.3 68.7,40.9 68.2,41.4 67.6,41.4
  pour Bottom (no thermals): 69,36 69.1,36.1 69.1,36.9 69,37 68.8,37 68.7,36.9 68.7,36.1 68.8,36
  pour Top (no thermals): 69.1,36.1 69,36 68.1,36 68,36.1 68,36.9 68.1,37 69,37 69.1,36.9
  pour Route2 (no thermals): 69,36 69.1,36.1 69.1,36.9 69,37 68.8,37 68.7,36.9 68.7,36.1 68.8,36
  pour Bottom (no thermals): 51.8,36.3 51.7,36.2 51.7,35.4 51.8,35.3 52,35.3 52.1,35.4 52.1,36.2 52,36.3
  pour Top (no thermals): 51.7,36.2 51.8,36.3 52.7,36.3 52.8,36.2 52.8,35.4 52.7,35.3 51.8,35.3 51.7,35.4
  pour Route2 (no thermals): 51.8,36.3 51.7,36.2 51.7,35.4 51.8,35.3 52,35.3 52.1,35.4 52.1,36.2 52,36.3
  pour Bottom (no thermals): 49.4,37.5 49.5,37.4 50.3,37.4 50.4,37.5 50.4,37.7 50.3,37.8 49.5,37.8 49.4,37.7
  pour Top (no thermals): 49.5,37.4 49.4,37.5 49.4,38.4 49.5,38.5 50.3,38.5 50.4,38.4 50.4,37.5 50.3,37.4
  pour Route2 (no thermals): 49.4,37.5 49.5,37.4 50.3,37.4 50.4,37.5 50.4,37.7 50.3,37.8 49.5,37.8 49.4,37.7
  pour Bottom (no thermals): 53.5,41.6 53.6,41.5 54.4,41.5 54.5,41.6 54.5,41.8 54.4,41.9 53.6,41.9 53.5,41.8
  pour Top (no thermals): 53.6,41.5 53.5,41.6 53.5,42.5 53.6,42.6 54.4,42.6 54.5,42.5 54.5,41.6 54.4,41.5
  pour Route2 (no thermals): 53.5,41.6 53.6,41.5 54.4,41.5 54.5,41.6 54.5,41.8 54.4,41.9 53.6,41.9 53.5,41.8
  pour Route2 (no thermals): 47.8,47.1 47.7,47 47.7,46.2 47.8,46.1 48,46.1 48.1,46.2 48.1,47 48,47.1
  pour Bottom (no thermals): 52.3,46.1 52.4,46.2 52.4,47 52.3,47.1 52.1,47.1 52,47 52,46.2 52.1,46.1
  pour Top (no thermals): 52.4,46.2 52.3,46.1 51.4,46.1 51.3,46.2 51.3,47 51.4,47.1 52.3,47.1 52.4,47
  pour Route2 (no thermals): 52.3,46.1 52.4,46.2 52.4,47 52.3,47.1 52.1,47.1 52,47 52,46.2 52.1,46.1
  pour Bottom (no thermals): 50.4,50.6 50.5,50.5 51.3,50.5 51.4,50.6 51.4,50.8 51.3,50.9 50.5,50.9 50.4,50.8
  pour Top (no thermals): 50.5,50.5 50.4,50.6 50.4,51.5 50.5,51.6 51.3,51.6 51.4,51.5 51.4,50.6 51.3,50.5
  pour Route2 (no thermals): 50.4,50.6 50.5,50.5 51.3,50.5 51.4,50.6 51.4,50.8 51.3,50.9 50.5,50.9 50.4,50.8
  pour Bottom (no thermals): 51.4,56.6 51.3,56.7 50.5,56.7 50.4,56.6 50.4,56.4 50.5,56.3 51.3,56.3 51.4,56.4
  pour Top (no thermals): 51.3,56.7 51.4,56.6 51.4,55.7 51.3,55.6 50.5,55.6 50.4,55.7 50.4,56.6 50.5,56.7
  pour Route2 (no thermals): 51.4,56.6 51.3,56.7 50.5,56.7 50.4,56.6 50.4,56.4 50.5,56.3 51.3,56.3 51.4,56.4
  pour Top (no thermals): 65.3,55.4 63.3,55.4 63,55.1 63,54.3 65.6,54.3 65.6,55.1
  pour Route2 (no thermals): 63.3,55.4 63.2,55.3 63.2,55.1 64,54.3 64.6,54.3 65.4,55.1 65.4,55.3 65.3,55.4
  pour Bottom (no thermals): 63.3,55.4 63.2,55.3 63.2,55.1 64,54.3 64.6,54.3 65.4,55.1 65.4,55.3 65.3,55.4
  pour Top (no thermals): 54.3,49.6 54.4,49.5 56.2,49.5 56.3,49.6 56.3,50.9 54.3,50.9
  pour Route2 (no thermals): 54.3,49.6 54.4,49.5 56.2,49.5 56.3,49.6 56.3,49.8 55.4,50.7 55.2,50.7 54.3,49.8
  pour Bottom (no thermals): 54.3,49.6 54.4,49.5 56.2,49.5 56.3,49.6 56.3,49.8 55.4,50.7 55.2,50.7 54.3,49.8
  pour Bottom (no thermals): 47.8,47.1 47.7,47 47.7,46.2 47.8,46.1 48,46.1 48.1,46.2 48.1,47 48,47.1
  pour Top (no thermals): 47.7,47 47.8,47.1 48.7,47.1 48.8,47 48.8,46.2 48.7,46.1 47.8,46.1 47.7,46.2
  pour Route15 (rank 2, no thermals): 69.2,32.3 32.8,32.3 32.3,32.8 32.3,51.4 38.2,57.3 67.3,57.3 67.8,56.8 67.8,43.4 69.7,41.5 69.7,32.8
  pour Top (rank 2, no thermals): 36.85,39.6 39.7,39.6 39.7,39 39.2,38.5 37.45,38.5 36.85,39.1
  pour Route2 (rank 2, no thermals): 37.5,38.6 37.6,38.5 39.2,38.5 39.3,38.6 39.3,38.8 38.5,39.6 38.3,39.6 37.5,38.8
  pour Bottom (rank 2, no thermals): 37.5,38.6 37.6,38.5 39.2,38.5 39.3,38.6 39.3,38.8 38.5,39.6 38.3,39.6 37.5,38.8
3.1V_2  (via drill 0.3, 0.3 pad 0.2)
  Top 0.25: v86.8,73.7 86.8,74 | 86.8,74 v86.8,74.3 | v86.8,81.8 86.8,82.1 | 86.8,82.1 v86.8,82.4 | v74.3,74.3 74.6,74.3 | 74.6,74.3 v74.9,74.3 | v72.8,71.3 72.8,71.6 | 72.8,71.6 v72.8,71.9 | v63.5,69.1 63.8,69.1 | 63.8,69.1 v64.1,69.1 | v63.3,73.5 63.3,73.2 | 63.3,73.2 v63.3,72.9 | v60.55,75 60.25,75 | 60.25,75 v59.95,75 | v55.45,75 55.15,75 | 55.15,75 v54.85,75 | v69.1,75.4 69.1,75.7 | 69.1,75.7 v69.1,76 | v71.6,88.9 71.3,88.9 | 71.3,88.9 v71,88.9 | C48.1 79.2,73.5 v79.2,74.3 | v79.2,74.3 79.2,75.1 C42.1 | v79.2,74.3 v80,74.3 | v80,74.3 FB5.2 | v80,75.1 v80,74.3 | v80,74.3 v80,73.5 | R23.2 86.8,74 | R6.2 86.8,82.1 | FB4.2 74.6,74.3 | C53.1 72.8,71.6 | 63.8,69.1 C59.1 64.05,69.75 65.25,70.95 U13.6 | 63.3,73.2 C50.1 64.2,72.95 U13.2 | C41.1 69.1,75.7 | 60.25,75 R25.2 | 55.15,75 R24.2 | R2.2 71.3,88.9 | 79.55,81.85 v79.3,82.1 v78.8,82.6 78.3,82.1 C25.1 | 79.55,81.85 v79.8,81.6 v80.3,81.1 79.85,80.65 C34.1 | v79.3,81.1 79.05,81.35 | 79.05,81.35 v78.8,81.6 | FB3.2 79.55,81.85 | 79.55,81.85 79.05,81.35 | C32.1 v71,82.3 | v71,82.3 FB2.2 | v71,82.3 v71.8,82.3 | v71.8,82.3 72.65,82.3 C30.1 | v71.8,81.5 v71.8,82.3 | v71.8,82.3 v71.8,83.1 v72.6,83.1 | U6.12 60.92,84.62 62.3,86 62.3,86.55 C13.1 | C13.1 63.4,86.75 | 63.4,86.75 C14.1 v64.3,87.4 | v63.4,86.5 63.4,86.75 | v63.4,87.4 63.4,86.75 | C13.1 v62.5,87.4 | U13.21 67.55,74.85 68.5,75.8 68.5,75.9 68,76.39 66.55,76.39 66.41,76.25 66.41,75.09 66.55,74.95 U13.23 | C36.1 63.4,78.95 | 63.4,78.95 C37.1 v64.3,79.6 | v63.4,78.7 63.4,78.95 | v63.4,79.6 63.4,78.95 | C36.1 v62.5,79.6 | U6.2 61.67,78.12 C36.1 | 52,82.65 C27.1 52.9,82.6 | 52,82.65 C26.1 v51.1,82 | v52,82.9 52,82.65 | v52,82 52,82.65 | 52.9,82.6 v52.9,82 | 52.9,82.6 52.98,82.67 U6.20 55.49,82.67 56.15,82.02 56.15,80.73 55.49,80.07 U6.24
  Top 0.25: v45.8,67.5 46.41,67.5 | 46.41,67.5 v46.5,67.5 | v46.5,67.5 v47.2,67.5 | v46.15,68.1 46.5,68.1 | 46.5,68.1 v46.85,68.1 46.8,68.1 C56.1 | v46.5,67.5 46.5,68.1 | U18.5 46.41,67.5 | U9.5 45.6,75.8 45.75,75.65 45.75,75.15 | C45.1 46.65,74.25 45.75,75.15 | U9.8 46.6,77 46.65,77.05 47.2,77.05 47.5,76.75 47.5,74.8 46.95,74.25 C45.1 | U12.5 46.5,72.9 46.8,73.2 v46.8,73.6 C45.1 | U12.8 45.15,74.55 45.75,75.15
  Route15 0.25: v46.8,73.6 46.8,73.2 45.7,72.1 45.7,68.55 v46.15,68.1
  Route15 1: v62.5,87.4 61.45,86.35 57.05,86.35 | 57.05,86.35 53.3,86.35 53.3,84.2 v52,82.9 | v71,88.9 68.85,88.9 67.35,87.4 v64.3,87.4 | v71,82.3 71,81.8 68.8,79.6 | 68.8,79.6 v64.3,79.6 | 57.05,86.35 57.05,85.05 v62.5,79.6 60.55,77.65 v60.55,75 61.8,75 v63.3,73.5 65.15,71.65 65.15,70.15 v64.1,69.1 | v52.9,82 55,79.9 55,75.15 v54.85,75 49.95,70.1 49.95,69.15 49,68.2 47.9,68.2 v47.2,67.5 | v72.8,71.9 72.8,72.8 v74.3,74.3 71.05,77.55 69.1,77.55 | v69.1,76 69.1,77.55 | 69.1,77.55 69.1,79.3 68.8,79.6 | v74.9,74.3 76.1,75.5 79.6,75.5 v80,75.1 80,80.8 v80.3,81.1 | v86.8,81.8 v86.8,74.3 | v86.8,82.4 86.8,83.5 80.25,90.05 72.75,90.05 v71.6,88.9
  pour Bottom (no thermals): 86.9,73.5 87,73.6 87,74.4 86.9,74.5 86.7,74.5 86.6,74.4 86.6,73.6 86.7,73.5
  pour Top (no thermals): 87,73.6 86.9,73.5 86,73.5 85.9,73.6 85.9,74.4 86,74.5 86.9,74.5 87,74.4
  pour Route2 (no thermals): 86.9,73.5 87,73.6 87,74.4 86.9,74.5 86.7,74.5 86.6,74.4 86.6,73.6 86.7,73.5
  pour Route2 (no thermals): 86.9,81.6 87,81.7 87,82.5 86.9,82.6 86.7,82.6 86.6,82.5 86.6,81.7 86.7,81.6
  pour Bottom (no thermals): 86.9,81.6 87,81.7 87,82.5 86.9,82.6 86.7,82.6 86.6,82.5 86.6,81.7 86.7,81.6
  pour Top (no thermals): 87,81.7 86.9,81.6 86,81.6 85.9,81.7 85.9,82.5 86,82.6 86.9,82.6 87,82.5
  pour Bottom (no thermals): 74.1,74.2 74.2,74.1 75,74.1 75.1,74.2 75.1,74.4 75,74.5 74.2,74.5 74.1,74.4
  pour Top (no thermals): 74.2,74.1 74.1,74.2 74.1,75.1 74.2,75.2 75,75.2 75.1,75.1 75.1,74.2 75,74.1
  pour Route2 (no thermals): 74.1,74.2 74.2,74.1 75,74.1 75.1,74.2 75.1,74.4 75,74.5 74.2,74.5 74.1,74.4
  pour Bottom (no thermals): 72.9,71.1 73,71.2 73,72 72.9,72.1 72.7,72.1 72.6,72 72.6,71.2 72.7,71.1
  pour Top (no thermals): 73,71.2 72.9,71.1 72,71.1 71.9,71.2 71.9,72 72,72.1 72.9,72.1 73,72
  pour Route2 (no thermals): 72.9,71.1 73,71.2 73,72 72.9,72.1 72.7,72.1 72.6,72 72.6,71.2 72.7,71.1
  pour Bottom (no thermals): 63.3,69 63.4,68.9 64.2,68.9 64.3,69 64.3,69.2 64.2,69.3 63.4,69.3 63.3,69.2
  pour Top (no thermals): 63.4,68.9 63.3,69 63.3,69.9 63.4,70 64.2,70 64.3,69.9 64.3,69 64.2,68.9
  pour Route2 (no thermals): 63.3,69 63.4,68.9 64.2,68.9 64.3,69 64.3,69.2 64.2,69.3 63.4,69.3 63.3,69.2
  pour Bottom (no thermals): 63.2,73.7 63.1,73.6 63.1,72.8 63.2,72.7 63.4,72.7 63.5,72.8 63.5,73.6 63.4,73.7
  pour Top (no thermals): 63.1,73.6 63.2,73.7 64.1,73.7 64.2,73.6 64.2,72.8 64.1,72.7 63.2,72.7 63.1,72.8
  pour Route2 (no thermals): 63.2,73.7 63.1,73.6 63.1,72.8 63.2,72.7 63.4,72.7 63.5,72.8 63.5,73.6 63.4,73.7
  pour Bottom (no thermals): 60.75,75.1 60.65,75.2 59.85,75.2 59.75,75.1 59.75,74.9 59.85,74.8 60.65,74.8 60.75,74.9
  pour Top (no thermals): 60.65,75.2 60.75,75.1 60.75,74.2 60.65,74.1 59.85,74.1 59.75,74.2 59.75,75.1 59.85,75.2
  pour Route2 (no thermals): 60.75,75.1 60.65,75.2 59.85,75.2 59.75,75.1 59.75,74.9 59.85,74.8 60.65,74.8 60.75,74.9
  pour Route2 (no thermals): 55.65,75.1 55.55,75.2 54.75,75.2 54.65,75.1 54.65,74.9 54.75,74.8 55.55,74.8 55.65,74.9
  pour Bottom (no thermals): 55.65,75.1 55.55,75.2 54.75,75.2 54.65,75.1 54.65,74.9 54.75,74.8 55.55,74.8 55.65,74.9
  pour Top (no thermals): 55.55,75.2 55.65,75.1 55.65,74.2 55.55,74.1 54.75,74.1 54.65,74.2 54.65,75.1 54.75,75.2
  pour Bottom (no thermals): 69.2,75.2 69.3,75.3 69.3,76.1 69.2,76.2 69,76.2 68.9,76.1 68.9,75.3 69,75.2
  pour Top (no thermals): 69.3,75.3 69.2,75.2 68.3,75.2 68.2,75.3 68.2,76.1 68.3,76.2 69.2,76.2 69.3,76.1
  pour Route2 (no thermals): 69.2,75.2 69.3,75.3 69.3,76.1 69.2,76.2 69,76.2 68.9,76.1 68.9,75.3 69,75.2
  pour Bottom (no thermals): 71.8,89 71.7,89.1 70.9,89.1 70.8,89 70.8,88.8 70.9,88.7 71.7,88.7 71.8,88.8
  pour Top (no thermals): 71.7,89.1 71.8,89 71.8,88.1 71.7,88 70.9,88 70.8,88.1 70.8,89 70.9,89.1
  pour Route2 (no thermals): 71.8,89 71.7,89.1 70.9,89.1 70.8,89 70.8,88.8 70.9,88.7 71.7,88.7 71.8,88.8
  pour Top (no thermals): 79,73 79,75.6 79.8,75.6 80.2,75.2 80.8,74.6 80.8,74 79.8,73
  pour Route2 (no thermals): 79,74.4 79.9,75.3 80.1,75.3 80.2,75.2 80.2,73.4 80.1,73.3 79.9,73.3 79,74.2
  pour Bottom (no thermals): 79,74.4 79.9,75.3 80.1,75.3 80.2,75.2 80.2,73.4 80.1,73.3 79.9,73.3 79,74.2
  pour Top (no thermals): 77.9,81.7 77.9,82.5 78.2,82.8 79.8,82.8 80.5,82.1 80.5,80.3 80.1,79.9 79.6,79.9 79.6,80.5 78.4,81.7
  pour Route2 (no thermals): 78.7,82.8 78.6,82.7 78.6,81.5 79.2,80.9 80.4,80.9 80.5,81 80.5,81.2 78.9,82.8
  pour Bottom (no thermals): 78.7,82.8 78.6,82.7 78.6,81.5 79.2,80.9 80.4,80.9 80.5,81 80.5,81.2 78.9,82.8
  pour Top (no thermals): 70.6,83.3 72.7,83.3 72.8,83.2 73.1,82.9 73.1,82 72.4,81.3 71.8,81.3 70.7,81.3 70.6,81.4
  pour Route2 (no thermals): 71.7,83.3 70.8,82.4 70.8,82.2 71.7,81.3 71.9,81.3 72.8,82.2 72.8,83.2 72.7,83.3
  pour Bottom (no thermals): 71.7,83.3 70.8,82.4 70.8,82.2 71.7,81.3 71.9,81.3 72.8,82.2 72.8,83.2 72.7,83.3
  pour Top (no thermals): 64.4,87.6 62.4,87.6 62.1,87.3 62.1,86.5 62.3,86.3 64.5,86.3 64.7,86.5 64.7,87.3
  pour Route2 (no thermals): 62.4,87.6 62.3,87.5 62.3,87.3 63.3,86.3 63.6,86.3 64.5,87.2 64.5,87.5 64.4,87.6
  pour Bottom (no thermals): 62.4,87.6 62.3,87.5 62.3,87.3 63.3,86.3 63.6,86.3 64.5,87.2 64.5,87.5 64.4,87.6
  pour Top (no thermals): 64.4,79.8 62.4,79.8 62.1,79.5 62.1,78.7 62.3,78.5 64.5,78.5 64.7,78.7 64.7,79.5
  pour Route2 (no thermals): 62.4,79.8 62.3,79.7 62.3,79.5 63.3,78.5 63.6,78.5 64.5,79.4 64.5,79.7 64.4,79.8
  pour Bottom (no thermals): 62.4,79.8 62.3,79.7 62.3,79.5 63.3,78.5 63.6,78.5 64.5,79.4 64.5,79.7 64.4,79.8
  pour Top (no thermals): 51,81.8 53,81.8 53.3,82.1 53.3,82.9 53.1,83.1 50.9,83.1 50.7,82.9 50.7,82.1
  pour Route2 (no thermals): 53,81.8 53.1,81.9 53.1,82.1 52.1,83.1 51.8,83.1 50.9,82.2 50.9,81.9 51,81.8
  pour Bottom (no thermals): 53,81.8 53.1,81.9 53.1,82.1 52.1,83.1 51.8,83.1 50.9,82.2 50.9,81.9 51,81.8
  pour Route15 (rank 2, no thermals): 89.9,64.3 90.4,64.8 90.4,95.3 89.9,95.8 45.5,95.8 45,95.3 45,64.8 45.5,64.3
  pour Route2 (rank 2, no thermals): 46.95,68.3 46.05,68.3 45.6,67.85 45.6,67.4 45.7,67.3 47.3,67.3 47.4,67.4 47.4,67.85
  pour Bottom (rank 2, no thermals): 46.95,68.3 46.05,68.3 45.6,67.85 45.6,67.4 45.7,67.3 47.3,67.3 47.4,67.4 47.4,67.85
  pour Top (rank 2, no thermals): 45.6,67.4 45.6,67.85 46.4,68.65 46.4,69 47.2,69 47.2,68.05 47.4,67.85 47.4,67.4 46.95,66.95 46.95,66.6 45.85,66.6 45.85,67.15
3.3V_0  (via drill 0.3, 0.3 pad 0.2)
  Top 0.2: U25.1 9,47.4 C98.1 8.8,47.55 8.5,47.85 v8.5,48.3 | U24.1 8.6,50.3 v8.5,50.4 | U32.1 8.3,42.3 8.15,42.45 8.15,44.48 v8.47,44.8
  Top 0.4: J2.B1 v6.7,83.4
  Bottom 0.2: v6.7,83.4 6.55,83.25 6.55,79.85 10.44,75.97 10.44,71.05 8.27,68.88 8.27,50.4 | 8.27,50.4 8.27,48.53 v8.5,48.3 8.27,48.07 8.27,44.99 v8.47,44.8 | v8.5,50.4 8.27,50.4
  Bottom 0.4: v6.7,83.4 J2.B1
3.3V_5  (via drill 0.3)
  Top 0.2: v7.75,39.4 C118.1 8.7,39.35 8.7,37.75 U35.1 | U36.1 v8.75,35.35
  Top 0.4: v6,78.4 J2.B6
  Bottom 0.2: v6,78.4 7.55,78.4 10.12,75.83 10.12,71.19 7.95,69.02 7.95,39.6 v7.75,39.4 7.75,36.35 v8.75,35.35
  Bottom 0.4: J2.B6 v6,78.4
3.3V_6  (via drill 0.3)
  Top 0.25: U37.100 18.5,9.75 C137.1 19.05,9.1 v19.6,8.55 | U37.11 21.55,17.8 C133.1 22.45,18 v22.9,18 | U37.28 17.5,27.95 C129.1 v16.35,28.4 | U37.50 6.5,27.85 C128.1 5.8,28.25 v5.25,28.25 | U23.14 26.43,46.73 C102.1 26.1,41 27.3,39.8 29.66,39.8 29.66,39.5 30.3,39.5 | U38.8 27.7,5.1 28.05,5.45 C138.1 28.4,5.25 v28.4,4.75 | U39.8 34.1,5.2 34.35,5.45 35.9,5.45 C139.1 36.9,4.45 v36.9,3.45 | U37.73 5.35,13.8 5.6,13.55 5.6,13.05 5.35,12.8 U37.75 3.45,12.8 C135.1 3,12.15 v3,11.55 2.9,11.45 R71.2 | R74.2 v19.75,5.2 R73.2 | v39.2,67.3 v39.2,66.7 v39.8,66.7 39.8,67 | v39.8,67.3 39.8,67 | 39.8,67 R30.2 41.1,67.55 41.1,68 40.95,68.15 U15.4 | U12.1 42.75,74.1 C44.1 42.45,74.4 v42.45,74.9 42.35,74.9 41.8,75.45 41.8,76.3 | U9.1 43.65,77 v43.45,77.2 43.25,77.2 42.35,76.3 41.8,76.3 | U7.16 10.05,79.2 C33.1 v8.7,79.6 | U3.16 22.6,82.5 23.15,81.95 C29.1 v23.15,80.85 | U4.16 35.6,82 C28.1 v35.45,80.9 | 41.8,76.3 41.5,76.6 41.5,77.75 42.25,78.5 FB1.1 | U30.1 36.85,42.7 C107.1 | U31.4 31.93,41.02 31.93,40.02 31.55,39.65 R64.2 30.3,39.5 | v29.7,39.8 v30.3,39.8 | v29.7,39.2 v30.3,39.2 30.3,39.5 | 30.3,39.5 v30.3,39.8 | v7.4,77.8 v6.6,77.8 6.4,77.8 v6,77.4 6.4,77 v6.6,77 v7.4,77 | U24.8 10.25,50.35 C87.1 10.25,52.15 v9.75,52.65 | U25.8 11.35,47.9 v11.45,48 11.45,48.24 10.59,49.1 U24.5 | U25.5 11.45,46.1 v11.45,45.65 | R4.2 32.65,86.85 32.1,86.3 32.1,83.95 | 32.1,83.95 R5.2 | v32,83.25 32.1,83.35 32.1,83.95 | C126.1 10.75,35.6 9.95,34.8 U36.8 | C126.1 11.15,37.25 10.7,37.7 U35.8 | U32.5 10.4,41.1 v10.55,40.95 | U32.8 10.35,42.3 v10.55,42.5 | v11.8,35.6 C126.1 | U26.1 36.85,45.6 36,44.75 36,43.5 36.65,42.85 C107.1 | C107.1 34.45,42.85 33.77,42.17 30.98,42.17 30.95,42.2 30.37,42.2 30.05,41.89 30.05,40.05 v30.3,39.8
  Top 0.25: U37.6 v18.2,15.3
  Top 0.4: J2.B7 v6,77.4
  Route15 0.25: v5.25,28.25 5.25,27.65 5.55,27.65 | 5.55,27.65 5.55,14.1 v3,11.55 18.4,11.55 | v19.6,8.55 19.6,11.55 18.4,11.55 | 18.4,11.55 18.4,13.5 19.57,14.67 | 19.57,14.67 v22.9,18 | v19.6,8.55 24.6,8.55 v28.4,4.75 29.9,3.25 36.7,3.25 v36.9,3.45 | 5.55,27.65 15.6,27.65 v16.35,28.4 18.4,30.45 18.4,36.15 | v19.6,8.55 19.6,5.35 v19.75,5.2 | v39.8,67.3 40.65,67.3 42.2,68.85 42.2,74.65 v42.45,74.9 | v7.4,77.8 7.4,78.3 v8.7,79.6 9.05,79.25 21.55,79.25 v23.15,80.85 23.4,80.6 29.9,80.6 32,82.7 v32,83.25 33.1,83.25 v35.45,80.9 | v9.75,52.65 11.7,50.7 11.7,48.25 v11.45,48 v11.45,45.65 10.55,44.75 v10.55,42.5 v10.55,40.95 11.8,39.7 v11.8,35.6 14.6,35.6 18,39 18,39.2 | v18.2,15.3 18.95,15.3 19.57,14.67
  Route15 1: v7.4,77 8.9,77 12,73.9 22.2,73.9 25.15,70.95 25.15,66.9 | 25.15,66.9 25.15,62.2 18,55.05 18,39.2 18,36.55 18.4,36.15 | 25.15,66.9 25.35,66.7 v39.2,66.7
  Bottom 0.4: v6,77.4 J2.B7
  pour Route15 (rank 3, no thermals): 89.9,0 2.5,0 2,0.5 2,28.8 2.5,29.3 11.3,29.3 11.8,29.8 11.8,32.2 11.3,32.7 0.5,32.7 0,33.2 0,70.5 0.5,71 8.8,71 9.3,71.5 9.3,72.3 8.8,72.8 0.5,72.8 0,73.3 0,83.6 0.5,84.1 36.6,84.1 37.1,83.6 37.1,79.9 36.6,79.4 26.5,79.4 25.8,78.7 25.8,68.7 26.5,68 40.7,68 41.4,68.7 41.4,76.9 41.9,77.4 44.1,77.4 44.6,76.9 44.6,64.8 44.1,64.3 28.3,64.3 18.8,54.8 18.8,50.1 19.5,49.4 31.4,49.4 31.9,48.9 31.9,32.6 32.6,31.9 89.9,31.9 90.4,31.4 90.4,0.5
  pour Route2 (rank 2, no thermals): 39,66.6 39.1,66.5 39.9,66.5 40,66.6 40,67.4 39.9,67.5 39.1,67.5 39,67.4
  pour Bottom (rank 2, no thermals): 39,66.6 39.1,66.5 39.9,66.5 40,66.6 40,67.4 39.9,67.5 39.1,67.5 39,67.4
  pour Top (rank 2, no thermals): 39,67.4 39,66.6 39.1,66.5 40.1,66.5 40.25,66.65 40.75,66.65 40.75,67.35 40.25,67.35 40.1,67.5 39.1,67.5
  pour Route2 (no thermals): 29.6,40 29.5,39.9 29.5,39.1 29.6,39 30.4,39 30.5,39.1 30.5,39.9 30.4,40
  pour Top (rank 2, no thermals): 29.1,39.9 29.6,40.4 30.8,40.4 31.35,39.85 31.75,39.85 31.75,39.15 31.35,39.15 30.8,38.6 29.6,38.6 29.1,39.1
  pour Bottom (no thermals): 7.5,78 6.3,78 5.8,77.5 5.8,77.3 6.3,76.8 7.5,76.8 7.6,76.9 7.6,77.9
  pour Top (no thermals): 7.5,78 6.3,78 5.8,77.5 5.8,77.3 6.3,76.8 7.5,76.8 7.6,76.9 7.6,77.9
  pour Route2 (no thermals): 7.5,78 6.3,78 5.8,77.5 5.8,77.3 6.3,76.8 7.5,76.8 7.6,76.9 7.6,77.9
5.0V  (via drill 0.3)
  Top 0.25: R41.2 69.3,62.15 69.3,63.4 69.2,63.5 64.3,63.5 63.75,62.95 R40.2 v62.65,62.95 | v33.8,61.5 v34.5,61.5 v34.5,60.8 34.5,60.3 | 34.5,60.3 v34.5,60.1 v34.5,59.4 34.55,59.35 Q4.5 Q4.6 36.2,59.35 | Q4.8 Q4.7 36.2,59.35 | 34.5,60.3 v33.8,60.3 33.8,60.45 R43.2 | Q4.PAD 36.2,59.35 | U21.9 13.47,58.67 C73.1 13.75,56.7 | C67.1 9.05,63.8 R38.2 8.1,62.85 8.1,58.2 9.6,56.7 13.75,56.7 | v19.4,53.7 v19.4,53 v19.4,52.3 v19.4,51.6 | v20.1,51.6 v20.1,52.3 v20.1,53 v20.1,53.7 v19.4,53.7 | C75.1 13.1,55.45 | 13.1,55.45 13.15,55.45 13.75,56.05 13.75,56.7 | 17.3,52.7 C84.A 15.1,53.45 13.1,55.45 | 17.3,52.7 18.4,52.7 v19.4,53.7 | R42.2 v28.05,60.2 | DS1.A 17.3,52.7
  Route15 0.25: v37.62,63.2 36.2,63.2 v34.5,61.5 | v28.05,60.2 28.3,59.95 33.45,59.95 v33.8,60.3
  Route15 1: v20.1,53.7 29.2,53.7 34.5,59 v34.5,59.4
  Bottom 0.25: v62.65,62.95 62.02,62.33 38.49,62.33 v37.62,63.2
  pour Top (rank 2, no thermals): 32.9,61.2 33.4,61.7 34.7,61.7 34.95,61.45 37.4,61.45 37.4,59.05 34.55,59.05 34.3,59.3 34.3,59.8 34,60.1 33.45,60.1 32.9,60.65
  pour Top (no thermals): 12.8,60.3 12.8,59.05 12.9,58.95 12.9,56.15 12.65,55.9 10.95,55.9 10.95,55 12.75,55 14.35,53.4 14.35,51.25 20.22,51.25 20.42,51.45 20.42,53.6 14.15,59.87 14.15,60.3
  pour Route2 (no thermals): 33.7,61.7 33.6,61.6 33.6,60 34.4,59.2 34.6,59.2 34.7,59.3 34.7,61.6 34.6,61.7
  pour Bottom (no thermals): 33.7,61.7 33.6,61.6 33.6,60 34.4,59.2 34.6,59.2 34.7,59.3 34.7,61.6 34.6,61.7
  pour Route2: 19.3,53.9 19.2,53.8 19.2,51.5 19.3,51.4 20.2,51.4 20.3,51.5 20.3,53.8 20.2,53.9
  pour Route15: 19.2,54.7 19.2,50.3 19.7,49.8 31.4,49.8 31.9,50.3 31.9,51.5 37.8,57.4 37.8,63.4 37.3,63.9 28.4,63.9
5.0V_1  (via drill 0.3, 0.3 pad 0.2)
  Top 0.25: U27.2 77.9,42.8 77.25,42.15 77.1,42.15 C115.1 | C115.1 v76.6,42.3 | C116.1 75.05,41.5 v75.8,41.5 76.45,41.5 C115.1 | R63.2 v71.85,41.55 R61.2 v71.85,43.25 L8.1 71.7,43.95 v71.15,43.95 | v71.15,43.95 70.5,43.95 C110.1 | v71.15,43.25 v71.15,43.95 | v71.15,44.65 v71.15,43.95 | v38.25,59.65 38.25,60.15 v38.4,60.3 v39.1,60.3 | v39.1,60.3 v39.8,60.3 39.95,60.15 v39.95,59.65 | U20.5 40.15,61.3 39.75,61.7 39.3,61.7 39.1,61.5 R44.1 v39.1,60.3 | C72.1 v39.1,60.3
  Top 0.3: v75.7,46.8 75.7,47.5 | 75.7,47.5 v75.7,47.6 v75.7,48.4 | v75.7,48.4 75.3,48.4 | 75.3,48.4 v74.9,48.4 | v75.7,48.4 v76.5,48.4 v76.5,49.2 | L6.2 76.35,47.5 75.7,47.5 | C96.1 75.7,47.5 | C93.1 75.35,48.45 75.3,48.4
  Route15 1: v71.15,44.65 71.15,46.75 72.8,48.4 v74.9,48.4 74.9,50.95 67.7,58.15 41.45,58.15 v39.95,59.65 | v75.8,41.5 73.6,41.5 v71.85,43.25
  pour Top (no thermals): 74.7,50.1 74.7,47.1 75.2,46.6 76.3,46.6 76.7,47 76.7,49.5 75.8,50.4 75,50.4
  pour Route2 (no thermals): 74.7,48.5 75.6,49.4 76.6,49.4 76.7,49.3 76.7,47.5 75.8,46.6 75.6,46.6 74.7,47.5
  pour Bottom (no thermals): 74.7,48.5 75.6,49.4 76.6,49.4 76.7,49.3 76.7,47.5 75.8,46.6 75.6,46.6 74.7,47.5
  pour Top (no thermals): 74.5,41.1 76.7,41.1 77,41.4 77,42.2 76.7,42.5 76.5,42.5 75.6,41.6 74.5,41.6
  pour Route2 (no thermals): 75.6,41.4 75.7,41.3 75.9,41.3 76.8,42.2 76.8,42.4 76.7,42.5 76.5,42.5 75.6,41.6
  pour Bottom (no thermals): 75.6,41.4 75.7,41.3 75.9,41.3 76.8,42.2 76.8,42.4 76.7,42.5 76.5,42.5 75.6,41.6
  pour Top (no thermals): 69.9,44.4 69.9,44.2 71.7,42.4 72.1,42.4 72.1,44.5 71.75,44.85 70.35,44.85
  pour Route2 (no thermals): 71.05,44.85 70.95,44.75 70.95,43.15 71.1,43 71.9,43 72.05,43.15 72.05,43.35 71.4,44 71.4,44.7 71.25,44.85
  pour Bottom (no thermals): 71.05,44.85 70.95,44.75 70.95,43.15 71.1,43 71.9,43 72.05,43.15 72.05,43.35 71.4,44 71.4,44.7 71.25,44.85
  pour Route15 (rank 2, no thermals): 38.2,63.4 38.2,58.2 38.7,57.7 67.4,57.7 68.2,56.9 68.2,43.5 70.1,41.6 70.1,32.8 70.6,32.3 89.9,32.3 90.4,32.8 90.4,63.4 89.9,63.9 38.7,63.9
  pour Top (no thermals): 38.7,61.2 38.05,60.55 38.05,59.55 38.2,59.4 39.95,59.4 40.15,59.6 40.15,60.55 39.5,61.2
  pour Route2 (no thermals): 38.05,59.55 38.05,60.25 38.3,60.5 39.9,60.5 40.15,60.25 40.15,59.6 39.95,59.4 38.2,59.4
  pour Bottom (no thermals): 38.05,59.55 38.05,60.25 38.3,60.5 39.9,60.5 40.15,60.25 40.15,59.6 39.95,59.4 38.2,59.4
!ADC_RESET  (via drill 0.3)
  Top 0.16: U4.17 36.1,82.75 v36.15,82.7 | v12.6,78.35 12.7,78.45 U7.17 | U3.17 23.1,82.8 v23.15,82.75 | U37.29 17,26.01 17.27,25.75 18.73,25.75 20.39,27.4 21.89,27.4 22.43,27.95 24.55,27.95 v24.95,27.54
  Bottom 0.16: v12.6,78.35 12.6,81.11 15.29,83.8 20.29,83.8 20.62,83.47 21.28,83.47 21.95,84.14 23.15,84.14 | 23.15,84.14 32.95,84.14 34.39,82.7 v36.15,82.7 35.52,82.06 31.73,82.06 30.72,81.06 30.72,66.3 30.05,65.63 30.05,60.33 32.76,57.62 32.76,43.77 32.22,43.23 32.22,41.26 31.78,40.82 31.78,32.88 26.57,27.67 25.07,27.67 v24.95,27.54 | v23.15,82.75 23.15,84.14
!BUS_COM_SPI_CS  (via drill 0.3)
  Top 0.16: U25.3 6.2,46.6 v6,46.4
  Top 0.4: v6,46.4 J2.B36
  Bottom 0.4: J2.B36 v6,46.4
!COM_SPI_CS  (via drill 0.3)
  Top 0.16: U25.6 12.39,46.6 v12.45,46.55 | v15.24,29.09 14,27.85 U37.35
  Bottom 0.16: v12.45,46.55 12.23,46.32 12.23,45.32 10.02,43.11 10.02,40.3 15.02,35.3 15.02,29.31 v15.24,29.09
!DEMOD_CS  (via drill 0.3, 0.3 pad 0.2)
  Top 0.16: U13.19 68.55,74.25 68.9,74.6 v69,74.6 | v46.95,76.5 46.85,76.6 U9.7
  Bottom 0.16: v69,74.6 69,74.79 68.56,75.23 68.56,75.85 67.67,76.74 47.19,76.74 v46.95,76.5
!FLASH_CS-A  (via drill 0.3)
  Top 0.16: U39.1 34.1,10 32.8,8.7 24.15,8.7 22.62,7.17 14.22,7.17 v14,6.95 | U37.91 14,10.25 14.5,9.75 14.5,8.45 v14,7.95
  Bottom 0.16: v14,6.95 v14,7.95
!FLASH_CS-B
  Top 0.16: U38.1 26.3,10.99 25.8,11.5 24.65,11.5 24.5,11.35 24.5,9.85 22.38,7.73 17.59,7.73 16,9.31 U37.95
!FLASH_WP
  Top 0.16: U39.3 31.57,10.02 31.05,9.5 27.85,9.5 27.7,9.65 27.7,11.2 27.1,11.8 24.55,11.8 23.77,11.02 U38.3 23.77,9.52 22.26,8.01 17.7,8.01 16.5,9.21 U37.96
!MOD_CS  (via drill 0.3, 0.3 pad 0.2)
  Top 0.16: U29.19 52.65,41.85 v53,41.5 | v41.8,42.6 41.55,42.85 41.55,44.75 41.1,45.2 U26.7
  Bottom 0.16: v53,41.5 52.98,41.52 47.98,41.52 47.13,42.37 42.03,42.37 v41.8,42.6
!NRST  (via drill 0.3)
  Top 0.16: v7.21,14.97 7.71,15.47 7.71,16.87 10.24,19.4 17.95,19.4 18.05,19.3 U37.14 21.15,19.3 22.1,20.25 C130.1
  Bottom 0.16: J3.5 9.26,8.09 6.99,10.36 6.99,14.75 v7.21,14.97
!PC_5.0V-1  (via drill 0.3)
  Top 0.16: R43.1 Q4.4 v35.23,63.17 | U37.17 19.4,20.8 v19.2,21
  Bottom 0.16: v35.23,63.17 35,62.95 35,42.8 34.46,42.27 34.46,19.02 34.29,18.85 34.29,18.6 32.39,16.7 29.05,16.7 24.8,12.45 21.09,12.45 19.28,14.26 19.28,19.87 19.5,20.09 19.5,20.7 v19.2,21
!RFCLK_CS-DEMOD  (via drill 0.3)
  Top 0.16: U9.2 43.42,76.6 v43.31,76.49 | v27.47,25.86 27.47,25.35 24.95,22.83 23.77,22.83 22.24,21.3 U37.18
  Bottom 0.16: v43.31,76.49 41.95,75.12 41.95,72.36 33.3,63.71 33.3,59.89 34.72,58.47 34.72,42.92 34.18,42.38 34.18,32.88 27.47,26.17 v27.47,25.86
!RFCLK_CS-MOD  (via drill 0.3)
  Top 0.16: U26.2 37.62,45.2 v37.48,45.05 | U37.83 10,11.85 11.25,13.1 v11.67,13.1
  Bottom 0.16: v37.48,45.05 37.26,44.84 37.26,42.54 37.42,42.38 37.42,41.17 37.19,40.94 37.19,37.83 36.69,37.33 36.69,17.12 35.9,16.32 34.02,16.32 32.99,15.3 29.65,15.3 25.4,11.05 14.41,11.05 12.61,12.85 11.92,12.85 v11.67,13.1
!RX_LNA_EN  (via drill 0.3)
  Top 0.16: Q2.5 v85.7,76.3 Q2.2 | v77.1,86.1 Q1.5 | U37.15 v18.48,19.8
  Bottom 0.16: v77.1,86.1 80.7,86.1 84.4,82.4 84.4,76.55 | 84.4,76.55 85.45,76.55 v85.7,76.3 | 84.4,76.55 79.6,76.55 79.4,76.35 70.26,76.35 69.03,77.58 46.52,77.58 44,75.06 44,72.2 43.75,71.95 42.74,71.95 36.84,66.05 36.84,45.92 36.42,45.5 36.42,42.11 36.58,41.95 36.58,41.53 36.35,41.3 36.35,38.19 35.85,37.69 35.85,17.48 35.53,17.16 33.66,17.16 32.63,16.14 29.29,16.14 25.04,11.89 20.85,11.89 18.72,14.02 18.72,19.56 v18.48,19.8
ADC_DCAP-0
  Top 0.16: U3.8 23.6,88.05 23.45,88.2 23.45,90 22.9,90.55 C1.1
ADC_DCAP-1